# EAGLE design ArduinoLab (EAGLE 5.11)
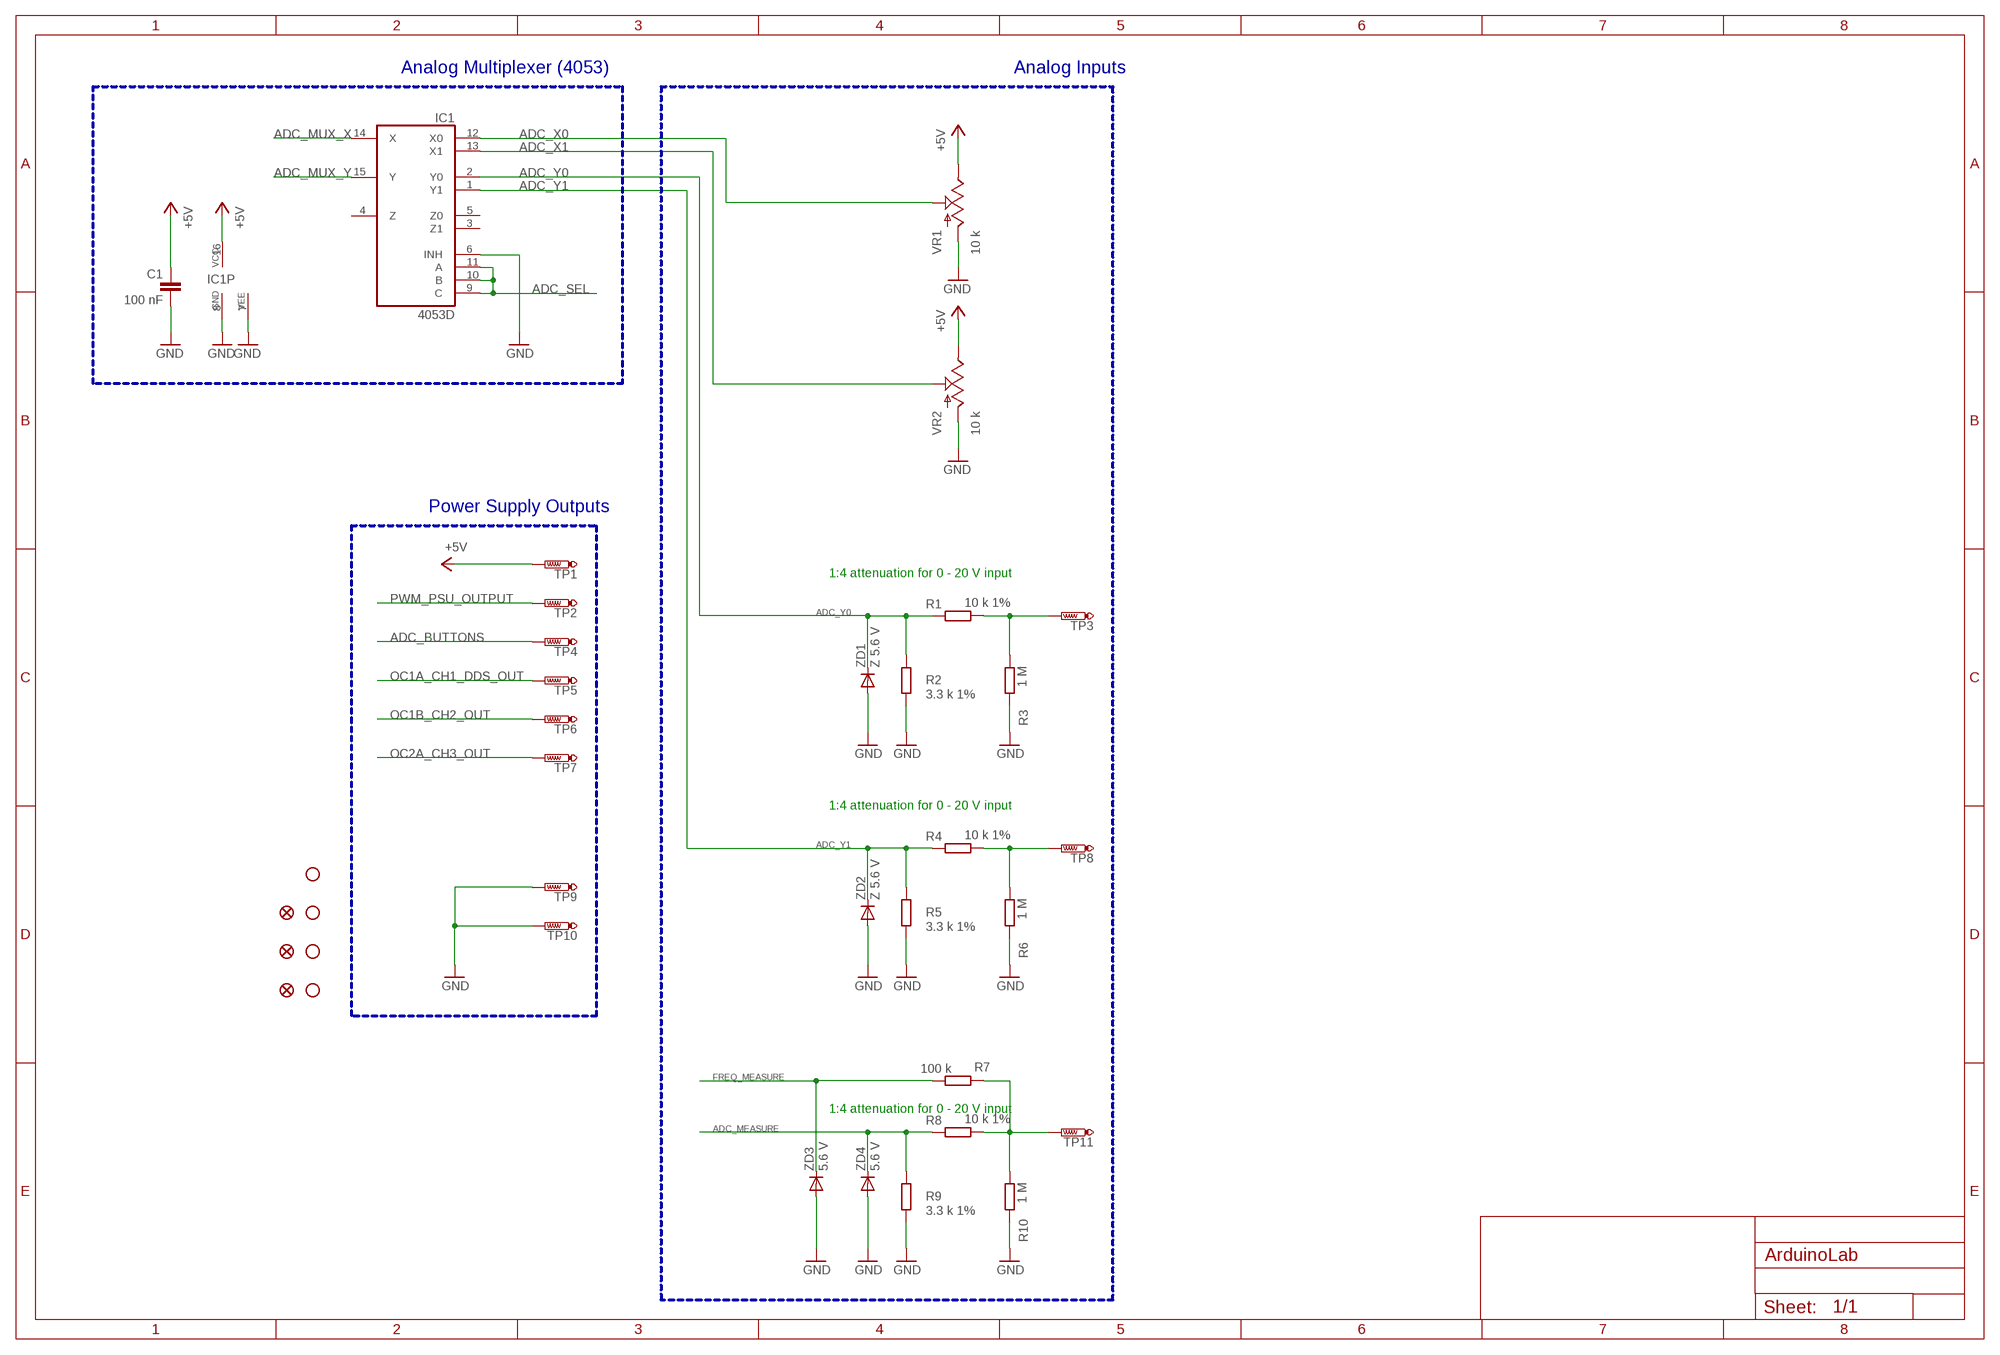
[diagram p0: schematic, sheet 1, part 1 of 3]
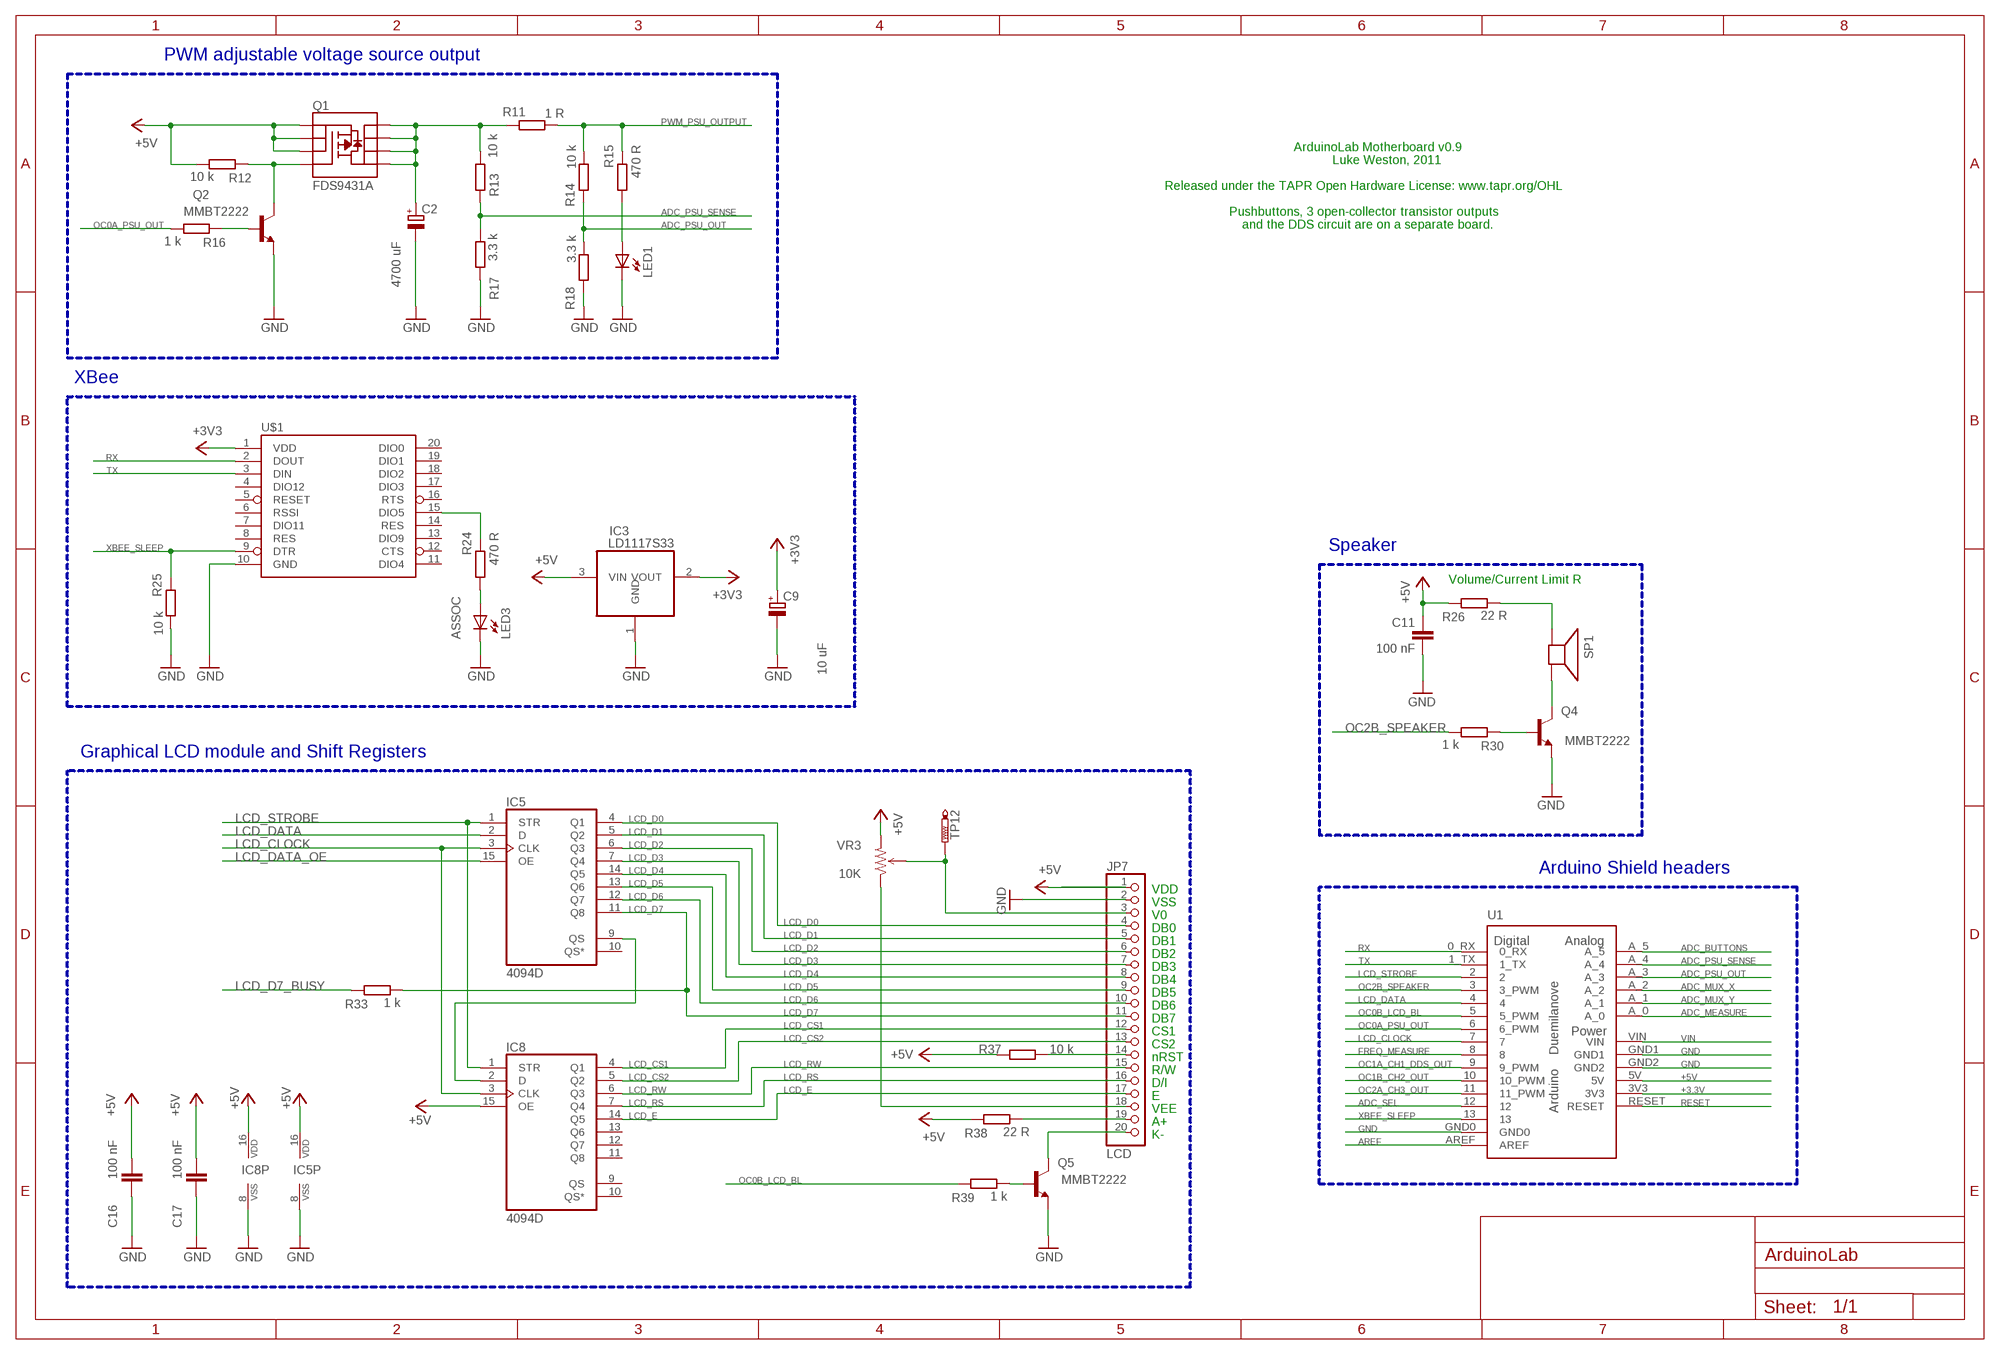
[diagram p1: schematic, sheet 1, part 2 of 3]
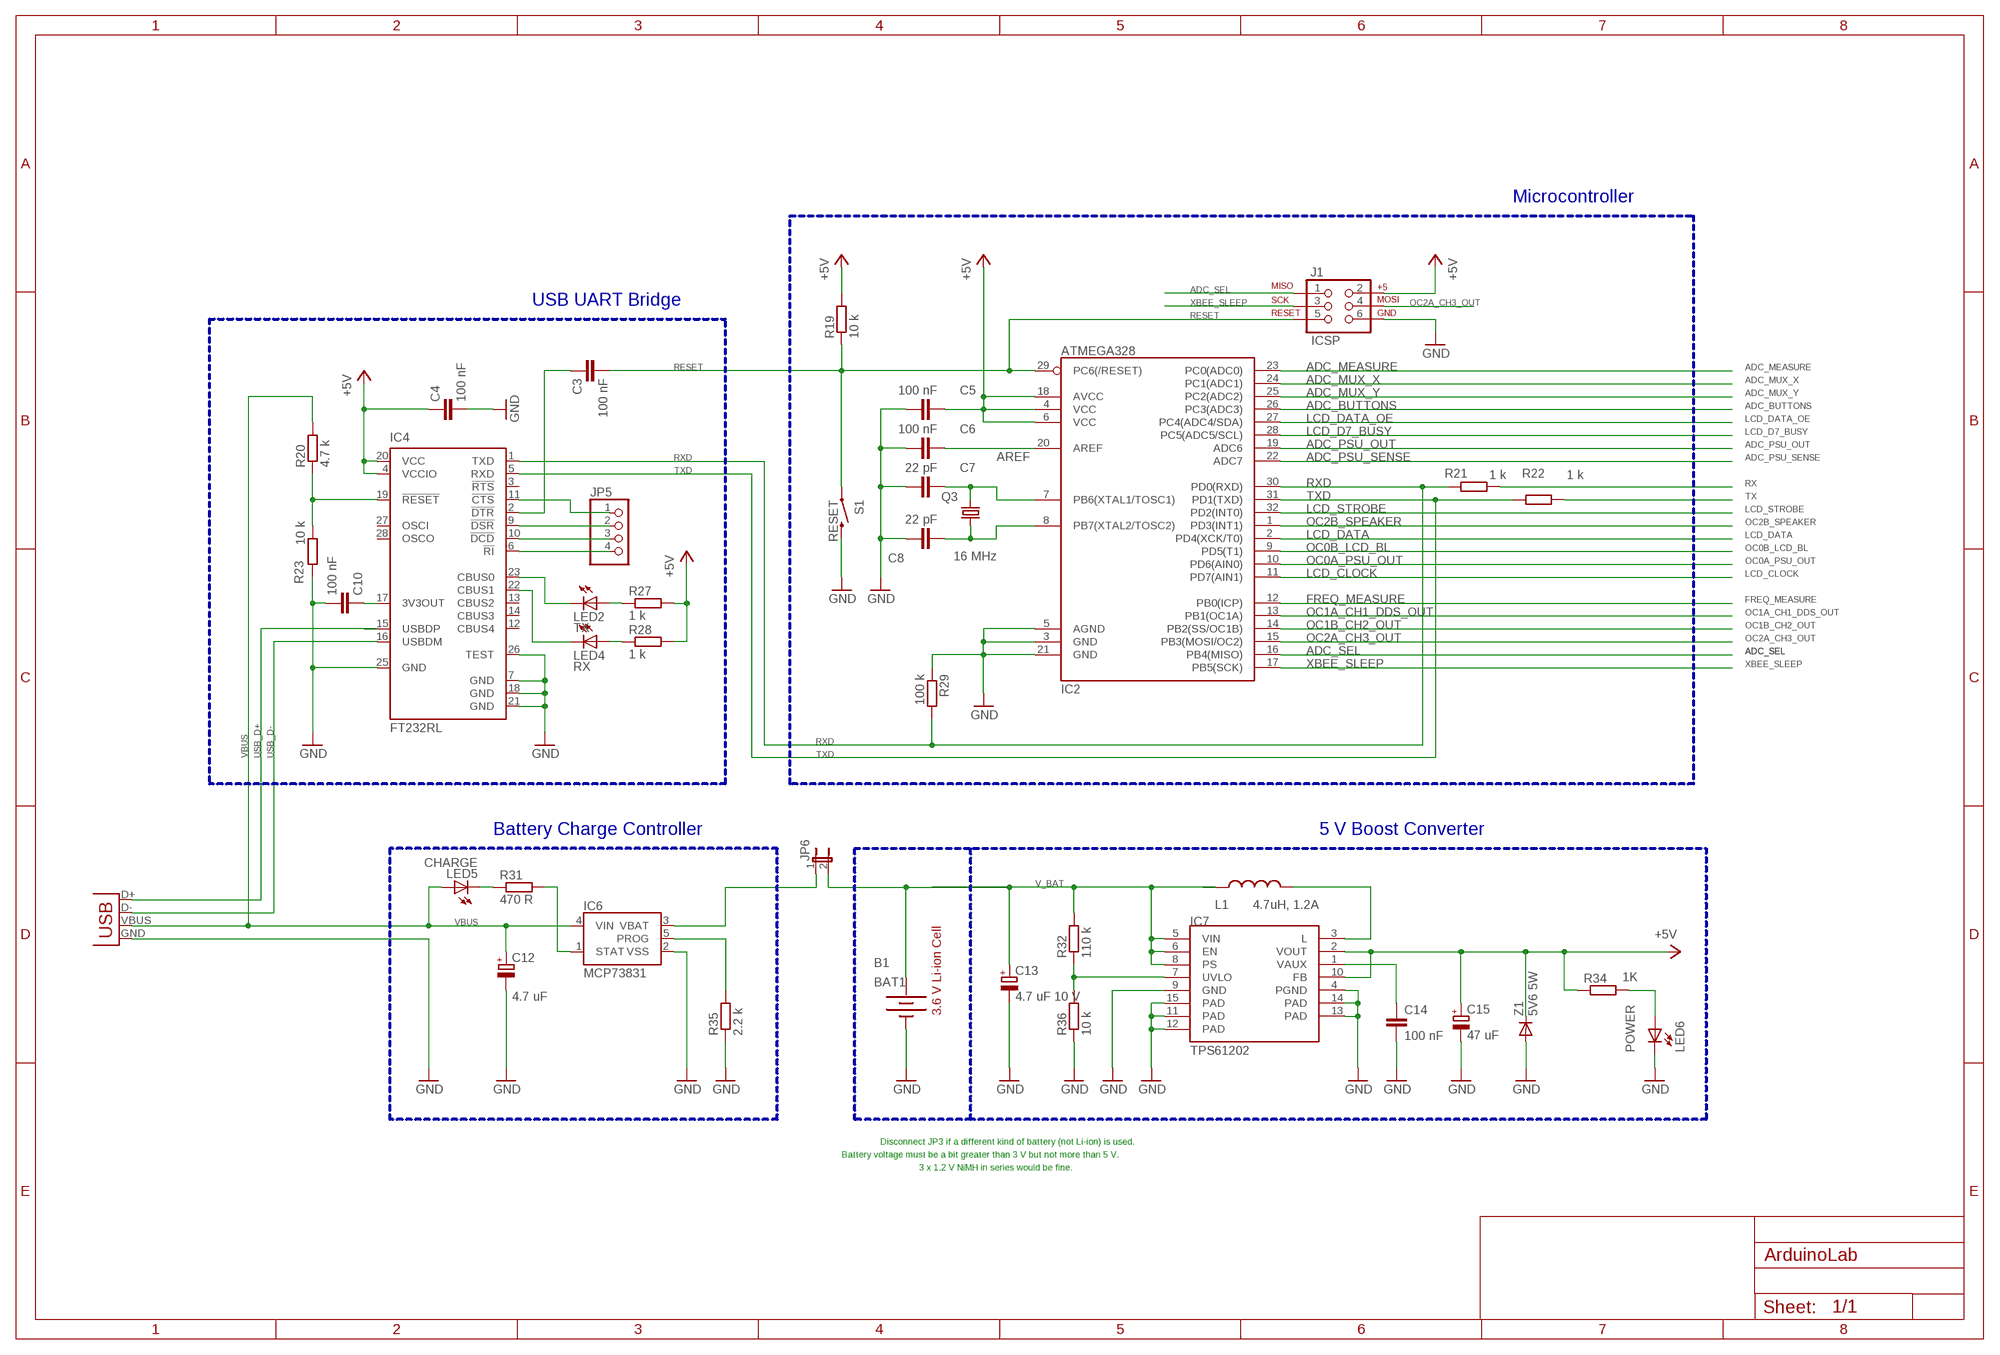
[diagram p2: schematic, sheet 1, part 3 of 3]

## Parts
BAT1  B1  BATTERYAA  [BATTERY-AA]
C1  100 nF  C-EUC0805K  [C0805K]
C2  4700 uF  CPOL-EUE5-13  [E5-13]
C3  100 nF  C-EUC0805K  [C0805K]
C4  100 nF  C-EUC0805K  [C0805K]
C5  100 nF  C-EUC0805K  [C0805K]
C6  100 nF  C-EUC0805K  [C0805K]
C7  22 pF  C-EUC0805K  [C0805K]
C8  22 pF  C-EUC0805K  [C0805K]
C9  10 uF  CPOL-EUSMCC  [SMC_C]
C10  100 nF  C-EUC0805K  [C0805K]
C11  100 nF  C-EUC0805K  [C0805K]
C12  4.7 uF  CPOL-EUSMCA  [SMC_A]
C13  4.7 uF 10 V  CPOL-EUSMCA  [SMC_A]
C14  100 nF  C-EUC0805K  [C0805K]
C15  47 uF  CPOL-EUSMCC  [SMC_C]
C16  100 nF  C-EUC0805K  [C0805K]
C17  100 nF  C-EUC0805K  [C0805K]
IC1  4053D  [SO16]
IC2  ATMEGA328  ATMEGA168  [TQFP32-08]
IC3  LD1117S33  REG1117  [SOT223]
IC4  FT232RL  [SSOP28]
IC5  4094D  [SO16]
IC6  MCP73831  [SOT23-5]
IC7  TPS61202  TPS61200  [QFN-10_PAD]
IC8  4094D  [SO16]
J1  ICSP  AVR_SPI_PRG_6NS  [2X3-NS]
JP1  STAND-OFF  [STAND-OFF]
JP2  STAND-OFF  [STAND-OFF]
JP3  STAND-OFF  [STAND-OFF]
JP4  STAND-OFF  [STAND-OFF]
JP5  PINHD-1X4  [1X04]
JP6  JP1E  [JP1]
JP7  LCD  PINHD-1X20  [1X20]
JP8  FIDUCIAL1.5X3  [FIDUCIAL-1.5X3]
JP9  FIDUCIAL1.5X3  [FIDUCIAL-1.5X3]
JP10  FIDUCIAL1.5X3  [FIDUCIAL-1.5X3]
L1  4.7uH, 1.2A  INDUCTOR-B82462G  [B82462G]
LED1  LEDCHIPLED_0805  [CHIPLED_0805]
LED2  TX  LEDCHIPLED_0805  [CHIPLED_0805]
LED3  ASSOC  LEDCHIPLED_0805  [CHIPLED_0805]
LED4  RX  LEDCHIPLED_0805  [CHIPLED_0805]
LED5  CHARGE  LEDCHIPLED_0805  [CHIPLED_0805]
LED6  POWER  LEDCHIPLED_0805  [CHIPLED_0805]
Q1  FDS9431A  MOSFET-PCHANNEL-SOIC8SOIC8  [SO08]
Q2  MMBT2222  MMBT2222ALT1-NPN-SOT23-BEC  [SOT23-BEC]
Q3  16 MHz  CRYSTALSM49  [SM49]
Q4  MMBT2222  MMBT2222ALT1-NPN-SOT23-BEC  [SOT23-BEC]
Q5  MMBT2222  MMBT2222ALT1-NPN-SOT23-BEC  [SOT23-BEC]
R1  10 k 1%  R-EU_R0805  [R0805]
R2  3.3 k 1%  R-EU_R0805  [R0805]
R3  1 M  R-EU_R0805  [R0805]
R4  10 k 1%  R-EU_R0805  [R0805]
R5  3.3 k 1%  R-EU_R0805  [R0805]
R6  1 M  R-EU_R0805  [R0805]
R7  100 k  R-EU_R0805  [R0805]
R8  10 k 1%  R-EU_R0805  [R0805]
R9  3.3 k 1%  R-EU_R0805  [R0805]
R10  1 M  R-EU_R0805  [R0805]
R11  1 R  R-EU_R2512  [R2512]
R12  10 k  R-EU_R0805  [R0805]
R13  10 k  R-EU_R0805  [R0805]
R14  10 k  R-EU_R0805  [R0805]
R15  470 R  R-EU_R0805  [R0805]
R16  1 k  R-EU_R0805  [R0805]
R17  3.3 k  R-EU_R0805  [R0805]
R18  3.3 k  R-EU_R0805  [R0805]
R19  10 k  R-EU_R0805  [R0805]
R20  4.7 k  R-EU_R0805  [R0805]
R21  1 k  R-EU_R0805  [R0805]
R22  1 k  R-EU_R0805  [R0805]
R23  10 k  R-EU_R0805  [R0805]
R24  470 R  R-EU_R0805  [R0805]
R25  10 k  R-EU_R0805  [R0805]
R26  22 R  R-EU_R0805  [R0805]
R27  1 k  R-EU_R0805  [R0805]
R28  1 k  R-EU_R0805  [R0805]
R29  100 k  R-EU_R0805  [R0805]
R30  1 k  R-EU_R0805  [R0805]
R31  470 R  R-EU_R0805  [R0805]
R32  110 k  R-EU_R0805  [R0805]
R33  1 k  R-EU_R0805  [R0805]
R34  1K  R-EU_R0805  [R0805]
R35  2.2 k  R-EU_R0805  [R0805]
R36  10 k  R-EU_R0805  [R0805]
R37  10 k  R-EU_R0805  [R0805]
R38  22 R  R-EU_R0805  [R0805]
R39  1 k  R-EU_R0805  [R0805]
S1  RESET  SWITCH-MOMENTARY-2SMD  [TACTILE_SWITCH_SMD]
SP1  SPEAKER/AL60P  [AL60P]
TP1  PTR1PAD1-13Y  [P1-13Y]
TP2  PTR1PAD1-13Y  [P1-13Y]
TP3  PTR1PAD1-13Y  [P1-13Y]
TP4  PTR1PAD1-13Y  [P1-13Y]
TP5  PTR1PAD1-13Y  [P1-13Y]
TP6  PTR1PAD1-13Y  [P1-13Y]
TP7  PTR1PAD1-13Y  [P1-13Y]
TP8  PTR1PAD1-13Y  [P1-13Y]
TP9  PTR1PAD1-13Y  [P1-13Y]
TP10  PTR1PAD1-13Y  [P1-13Y]
TP11  PTR1PAD1-13Y  [P1-13Y]
TP12  PTR1PAD1-13Y  [P1-13Y]
U1  ARDUINO-USBNO-OUTLINE-NO-TEXT-OCTAGONAL  [NO-OUTLINE-OCTAGONAL-NOTEXT]
U$1  XBEE-1B3  [XBEE-SMD]
VR1  10 k  POT100K_3362U  [3362U]
VR2  10 k  POT100K_3362U  [3362U]
VR3  10K  TRIMPOTSMD  [TRIMPOT-3MM]
X1  USB  USBOLD  [USB-MINIB-OLD]
Z1  5V6 5W  DIODE-D-10  [D-10]
ZD1  Z 5.6 V  DIODE-SOD323-W  [SOD323-W]
ZD2  Z 5.6 V  DIODE-SOD323-W  [SOD323-W]
ZD3  5.6 V  DIODE-SOD323-W  [SOD323-W]
ZD4  5.6 V  DIODE-SOD323-W  [SOD323-W]

## Nets
+3.3V: C9.+ IC3.2(VOUT) U1.3V3 U$1.1(VDD) ; supply symbol labelled +3V3
+5V: C1.1 C4.1 C5.1 C11.1 C15.+ C16.1 C17.1 IC1.16(VCC) IC2.4(VCC) IC2.6(VCC) IC2.18(AVCC) IC3.3(VIN) IC4.4(VCCIO) IC4.20(VCC) IC5.16(VDD) IC7.2(VOUT) IC7.10(FB) IC8.15(OE) IC8.16(VDD) J1.2 JP7.1 Q1.1(S) Q1.2(S) Q1.3(S) R12.1 R19.2 R26.1 R27.2 R28.2 R34.2 R37.2 R38.1 TP1.TP U1.5V VR1.P$1(E) VR2.P$1(E) VR3.3(CW) Z1.C
ADC_BUTTONS: IC2.26(PC3(ADC3)) TP4.TP U1.A_5
ADC_MEASURE: IC2.23(PC0(ADC0)) R8.2 R9.1 U1.A_0 ZD4.C
ADC_MUX_X: IC1.14(X) IC2.24(PC1(ADC1)) U1.A_2
ADC_MUX_Y: IC1.15(Y) IC2.25(PC2(ADC2)) U1.A_1
ADC_PSU_OUT: IC2.19(ADC6) R14.2 R18.1 U1.A_3
ADC_PSU_SENSE: IC2.22(ADC7) R13.1 R17.2 U1.A_4
ADC_SEL: IC1.9(C) IC1.10(B) IC1.11(A) IC2.16(PB4(MISO)) J1.1 U1.12
ADC_X0: IC1.12(X0) VR1.P$2(S)
ADC_X1: IC1.13(X1) VR2.P$2(S)
ADC_Y0: IC1.2(Y0) R1.2 R2.1 ZD1.C
ADC_Y1: IC1.1(Y1) R4.2 R5.1 ZD2.C
AREF: C6.2 IC2.20(AREF) U1.AREF
FREQ_MEASURE: IC2.12(PB0(ICP)) R7.2 U1.8 ZD3.C
GND: BAT1.GND@1(-) C1.2 C2.- C4.2 C5.2 C6.1 C7.1 C8.1 C9.- C10.2 C11.2 C12.- C13.- C14.2 C15.- C16.2 C17.2 IC1.6(INH) IC1.7(VEE) IC1.8(GND) IC2.3(GND) IC2.5(AGND) IC2.21(GND) IC3.1(GND) IC4.7(GND) IC4.18(GND) IC4.21(GND) IC4.25(GND) IC4.26(TEST) IC5.8(VSS) IC6.2(VSS) IC7.4(PGND) IC7.9(GND) IC7.11(PAD) IC7.12(PAD) IC7.13(PAD) IC7.14(PAD) IC7.15(PAD) IC8.8(VSS) J1.6 JP7.2 LED1.C LED3.C LED6.C Q2.E Q4.E Q5.E R2.2 R3.1 R5.2 R6.1 R9.2 R10.1 R17.1 R18.2 R23.1 R25.1 R29.1 R35.1 R36.1 S1.3 TP9.TP TP10.TP U1.GND0 U1.GND1 U1.GND2 U$1.10(GND) VR1.P$3(A) VR2.P$3(A) X1.GND Z1.A ZD1.A ZD2.A ZD3.A ZD4.A
LCD_CLOCK: IC2.11(PD7(AIN1)) IC5.3(CLK) IC8.3(CLK) U1.7
LCD_CS1: IC8.4(Q1) JP7.12
LCD_CS2: IC8.5(Q2) JP7.13
LCD_D0: IC5.4(Q1) JP7.4
LCD_D1: IC5.5(Q2) JP7.5
LCD_D2: IC5.6(Q3) JP7.6
LCD_D3: IC5.7(Q4) JP7.7
LCD_D4: IC5.14(Q5) JP7.8
LCD_D5: IC5.13(Q6) JP7.9
LCD_D6: IC5.12(Q7) JP7.10
LCD_D7: IC5.11(Q8) JP7.11 R33.2
LCD_D7_BUSY: IC2.28(PC5(ADC5/SCL)) R33.1
LCD_DATA: IC2.2(PD4(XCK/T0)) IC5.2(D) U1.4
LCD_DATA_OE: IC2.27(PC4(ADC4/SDA)) IC5.15(OE)
LCD_E: IC8.14(Q5) JP7.17
LCD_RESET: JP7.14 R37.1
LCD_RS: IC8.7(Q4) JP7.16
LCD_RW: IC8.6(Q3) JP7.15
LCD_STROBE: IC2.32(PD2(INT0)) IC5.1(STR) IC8.1(STR) U1.2
MEASURE_INPUT: R7.1 R8.1 R10.2 TP11.TP
N$1: LED3.A R24.2
N$2: R1.1 R3.2 TP3.TP
N$4: R26.2 SP1.1(+)
N$5: IC4.19(!RESET) R20.1 R23.2
N$6: IC7.3(L) L1.P$2
N$7: C7.2 IC2.7(PB6(XTAL1/TOSC1)) Q3.2
N$8: LED5.C R31.1
N$9: IC7.7(UVLO) R32.1 R36.2
N$10: C14.1 IC7.1(VAUX)
N$11: IC6.5(PROG) R35.2
N$12: C10.1 IC4.17(3V3OUT)
N$13: IC4.23(CBUS0) LED2.C
N$14: IC6.1(STAT) R31.2
N$15: IC4.22(CBUS1) LED4.C
N$16: C8.2 IC2.8(PB7(XTAL2/TOSC2)) Q3.1
N$17: C3.1 IC4.2(!DTR)
N$18: IC4.6(!RI) JP5.4
N$19: IC4.11(!CTS) JP5.1
N$20: IC4.9(!DSR) JP5.2
N$21: IC4.10(!DCD) JP5.3
N$22: LED2.A R27.1
N$23: LED4.A R28.1
N$30: IC6.3(VBAT) JP6.1
N$32: Q1.4(G) Q2.C R12.2
N$33: C2.+ Q1.5(D) Q1.6(D) Q1.7(D) Q1.8(D) R11.2 R13.2
N$38: LED6.A R34.1
N$42: JP7.3 TP12.TP VR3.2(WIPER)
N$44: JP7.18 VR3.1(CCW)
N$45: Q5.B R39.2
N$46: JP7.19 R38.2
N$47: JP7.20 Q5.C
N$48: IC5.9(QS) IC8.2(D)
N$52: Q2.B R16.2
N$53: R24.1 U$1.15(DIO5)
N$54: LED1.A R15.2
N$59: Q4.C SP1.2(-)
N$60: Q4.B R30.2
N$556: R4.1 R6.2 TP8.TP
OC0A_PSU_OUT: IC2.10(PD6(AIN0)) R16.1 U1.6(6_PWM)
OC0B_LCD_BL: IC2.9(PD5(T1)) R39.1 U1.5(5_PWM)
OC1A_CH1_DDS_OUT: IC2.13(PB1(OC1A)) TP5.TP U1.9(9_PWM)
OC1B_CH2_OUT: IC2.14(PB2(SS/OC1B)) TP6.TP U1.10(10_PWM)
OC2A_CH3_OUT: IC2.15(PB3(MOSI/OC2)) J1.4 TP7.TP U1.11(11_PWM)
OC2B_SPEAKER: IC2.1(PD3(INT1)) R30.1 U1.3(3_PWM)
PWM_PSU_OUTPUT: R11.1 R14.1 R15.1 TP2.TP
RESET: C3.2 IC2.29(PC6(/RESET)) J1.5 R19.1 S1.1 U1.RESET
RX: R21.1 U1.0_RX U$1.2(DOUT)
RXD: IC2.30(PD0(RXD)) IC4.1(TXD) R21.2 R29.2
TX: R22.1 U1.1_TX U$1.3(DIN)
TXD: IC2.31(PD1(TXD)) IC4.5(RXD) R22.2
USB_D+: IC4.15(USBDP) X1.D+
USB_D-: IC4.16(USBDM) X1.D-
V_BAT: BAT1.PWR@1(+) C13.+ IC7.5(VIN) IC7.6(EN) IC7.8(PS) JP6.2 L1.P$1 R32.2
VBUS: C12.+ IC6.4(VIN) LED5.A R20.2 X1.VBUS
VIN: U1.VIN
XBEE_SLEEP: IC2.17(PB5(SCK)) J1.3 R25.2 U1.13 U$1.9(DTR)
Unconnected: IC1.3(Z1) IC1.4(Z) IC1.5(Z0) IC4.3(!RTS) IC4.12(CBUS4) IC4.13(CBUS2) IC4.14(CBUS3) IC4.27(OSCI) IC4.28(OSCO) IC5.10(QS*) IC8.9(QS) IC8.10(QS*) IC8.11(Q8) IC8.12(Q7) IC8.13(Q6) U$1.4(DIO12) U$1.5(RESET) U$1.6(RSSI) U$1.7(DIO11) U$1.8(RES) U$1.11(DIO4) U$1.12(CTS) U$1.13(DIO9) U$1.14(RES) U$1.16(RTS) U$1.17(DIO3) U$1.18(DIO2) U$1.19(DIO1) U$1.20(DIO0)

## Buses
B$4
B$1
B$2
B$3

## Notes on the sheet
- Analog Multiplexer (4053) | Analog Inputs
- Power Supply Outputs
- 1:4 attenuation for 0 - 20 V input
- 1:4 attenuation for 0 - 20 V input
- 1:4 attenuation for 0 - 20 V input
- PWM adjustable voltage source output
- ArduinoLab Motherboard v0.9
- Luke Weston, 2011
- Released under the TAPR Open Hardware License: www.tapr.org/OHL
- Microcontroller
- Pushbuttons, 3 open-collector transistor outputs
- and the DDS circuit are on a separate board.
- USB UART Bridge
- XBee
- Speaker
- Volume/Current Limit R
- Graphical LCD module and Shift Registers
- Battery Charge Controller | 5 V Boost Converter
- Arduino Shield headers
- VDD
- VSS
- V0
- 3.6 V Li-ion Cell
- DB0
- DB1
- DB2
- DB3
- DB4
- DB5
- DB6
- DB7
- CS1
- CS2
- nRST
- R/W
- D/I
- E
- VEE
- A+
- K-
- Disconnect JP3 if a different kind of battery (not Li-ion) is used.
- Battery voltage must be a bit greater than 3 V but not more than 5 V.
- 3 x 1.2 V NiMH in series would be fine.

## Library data of the parts
BAT1 = SparkFun:BATTERY: Battery Holders Various common sizes : AA, AAA, 20mm coin cell and 12mm coin cell.
C1 C3-C8 C10 C11 C14 C16 C17 = rcl:C-EU: CAPACITOR, European symbol
C2 C9 C12 C13 C15 = rcl:CPOL-EU: POLARIZED CAPACITOR, European symbol
IC1 = 40xx:4053: Triple 2-channel ANALOG MULTIPLEXER
IC2 = SparkFun:ATMEGA168
IC3 = burr-brown:REG1117: 800mA and 1A Low Dropout (LDO) Positive Regulator 1.8V, 2.5V, 2.85V, 3.3V, 5V, and Adj; MPN: REG1117; OC_FARNELL: 1097566; OC_NEWARK: 14P6981
IC4 = ftdichip:FT232R: Source: http://www.ftdichip.com/Documents/DataSheets/DS_FT232R_v104.pdf; MPN: FT232RL; OC_FARNELL: 1146032; OC_NEWARK: 91K9918
IC5 IC8 = 40xx:4094: 8-stage SHIFT/STORE REGISTER, tri-state
IC6 = SparkFun:MCP73831: Microchip's MCP73831 Miniature single cell, fully integrated Li-Ion, Li-polymer charge management controller http://ww1.microchip.com/downloads/en/DeviceDoc/21984a.pdf
IC7 = SparkFun:TPS61200: DC to DC Booster
J1 = SparkFun:AVR_SPI_PRG_6: AVR ISP 6 Pin This is the reduced ISP connector for AVR programming. Common on Arduino. This footprint will take up less PCB space and can be used with a 10-pin to 6-pin adapter such as SKU: BOB-08508
JP1-JP4 = SparkFun:STAND-OFF: Stand Off This is the mechanical footprint for a #4 phillips button head screw. Use the keepout ring to avoid running the screw head into surrounding components. SKU : PRT-00447
JP5 = pinhead:PINHD-1X4: PIN HEADER
JP6 = jumper:JP1E: JUMPER
JP7 = pinhead:PINHD-1X20: PIN HEADER
JP8-JP10 = SparkFun:FIDUCIAL: Fiducial Alignment Points Various fiducial points for machine vision alignment.
L1 = SparkFun:INDUCTOR: Inductors Basic Inductor/Choke - 0603 and 1206. Footprints are not proven and vary greatly between part numbers.
LED1-LED6 = led:LED: LED OSRAM: - CHIPLED LG R971, LG N971, LY N971, LG Q971, LY Q971, LO R971, LY R971 LH N974, LH R974 LS Q976, LO Q976, LY Q976 LO Q996 - Hyper CHIPLED LW Q18S LB Q993, LB Q99A, LB R99A - SideLED LS A670, LO A670, LY A670, LG A670, LP A670 LB A673, LV A673, LT A673, LW A673 LH A674 LY A675 LS A676, LA A676, LO A676, LY A676, LW A676 LS A679, LY A679, LG A679 - Hyper Micro SIDELED® LS Y876, LA Y876, LO Y876, LY Y876 LT Y87S - SmartLED LW L88C, LW L88S LB L89C, LB L89S, LG L890 LS L89K, LO L89K, LY L89K LS L896, LA L896, LO L896, LY L896 - TOPLED LS T670, LO T670, LY T670, LG T670, LP T670 LSG T670, LSP T670, LSY T670, LOP T670, LYG T670 LG T671, LOG T671, LSG T671 LB T673, LV T673, LT T673, LW T673 LH T674 LS T676, LA T676, LO T676, LY T676, LB T676, LH T676, LSB T676, LW T676 LB T67C, LV T67C, LT T67C, LS T67K, LO T67K, LY T67K, LW E67C LS E67B, LA E67B, LO E67B, LY E67B, LB E67C, LV E67C, LT E67C LW T67C LS T679, LY T679, LG T679 LS T770, LO T770, LY T770, LG T770, LP T770 LB T773, LV T773, LT T773, LW T773 LH T774 LS E675, LA E675, LY E675, LS T675 LS T776, LA T776, LO T776, LY T776, LB T776 LHGB T686 LT T68C, LB T68C - Hyper Mini TOPLED® LB M676 - Mini TOPLED Santana® LG M470 LS M47K, LO M47K, LY M47K Source: http://www.osram.convergy.de LUXEON: - LUMILED® LXK2-PW12-R00, LXK2-PW12-S00, LXK2-PW14-U00, LXK2-PW14-V00 LXK2-PM12-R00, LXK2-PM12-S00, LXK2-PM14-U00 LXK2-PE12-Q00, LXK2-PE12-R00, LXK2-PE12-S00, LXK2-PE14-T00, LXK2-PE14-U00 LXK2-PB12-K00, LXK2-PB12-L00, LXK2-PB12-M00, LXK2-PB14-N00, LXK2-PB14-P00, LXK2-PB14-Q00 LXK2-PR12-L00, LXK2-PR12-M00, LXK2-PR14-Q00, LXK2-PR14-R00 LXK2-PD12-Q00, LXK2-PD12-R00, LXK2-PD12-S00 LXK2-PH12-R00, LXK2-PH12-S00 LXK2-PL12-P00, LXK2-PL12-Q00, LXK2-PL12-R00 Source: www.luxeon.com KINGBRIGHT: KA-3528ASYC Source: www.kingbright.com
Q1 = SparkFun:MOSFET-PCHANNEL-SOIC8
Q2 Q4 Q5 = transistor:*-NPN-: NPN Transistror BF959 corrected 2008.03.06
Q3 = crystal:CRYSTAL: CRYSTAL; OC_FARNELL: unknown; OC_NEWARK: unknown
R1-R39 = rcl:R-EU_: RESISTOR, European symbol
S1 = SparkFun:SWITCH-MOMENTARY-2
SP1 = adafruit:SPEAKER: SPEAKER Source: Buerklin Added PS12 (for part # PS1240 piezo) http://www.ladyada.net/library/pcb/eaglelibrary.html
TP1-TP12 = testpad:PTR1: TEST PIN
U1 = Arduino-Various:ARDUINO-USB: The Ardiuno Duemilanove Pinouts layoutet as a Bare Shield. v0.5 Also for Arduino Diecimila. This is designed as a Part and has no Outline in the Dimension Layer. The Outline, when present, is drawed at the tPlace / bPlace Layer. Library by Stephanie Lange, http://www.k-ita.de/~sl/
U$1 = SparkFun:XBEE-1
VR1 VR2 = SparkFun:POT
VR3 = SparkFun:TRIMPOT
X1 = SparkFun:USB: USB Connectors USB-B-PTH is fully proven SKU : PRT-00139 USB-miniB is fully proven SKU : PRT-00587 USB-A-PCB is untested. USB-A-H is throughly reviewed, but untested. Spark Fun Electronics SKU : PRT-00437 USB-B-SMT is throughly reviewed, but untested. Needs silkscreen touching up. USB-A-S has not been used/tested USB-MB-H has not been used/tested
Z1 ZD1-ZD4 = diode:DIODE-: DIODE

## Board
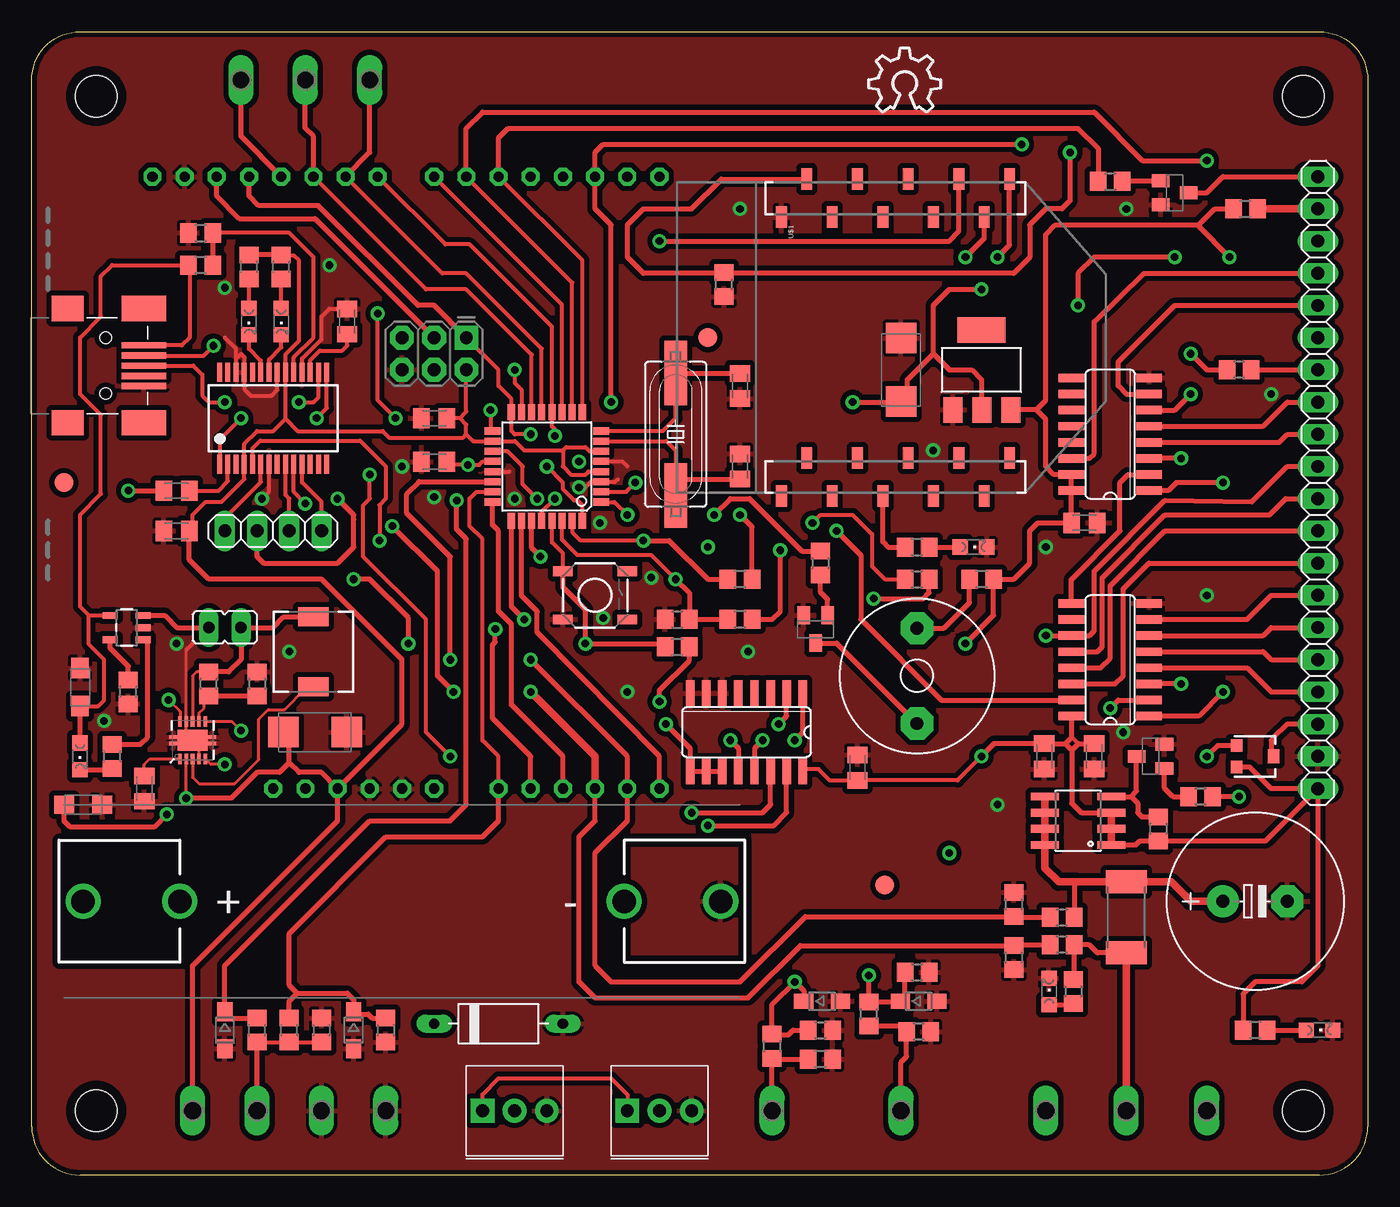
[diagram p3: board, top side]
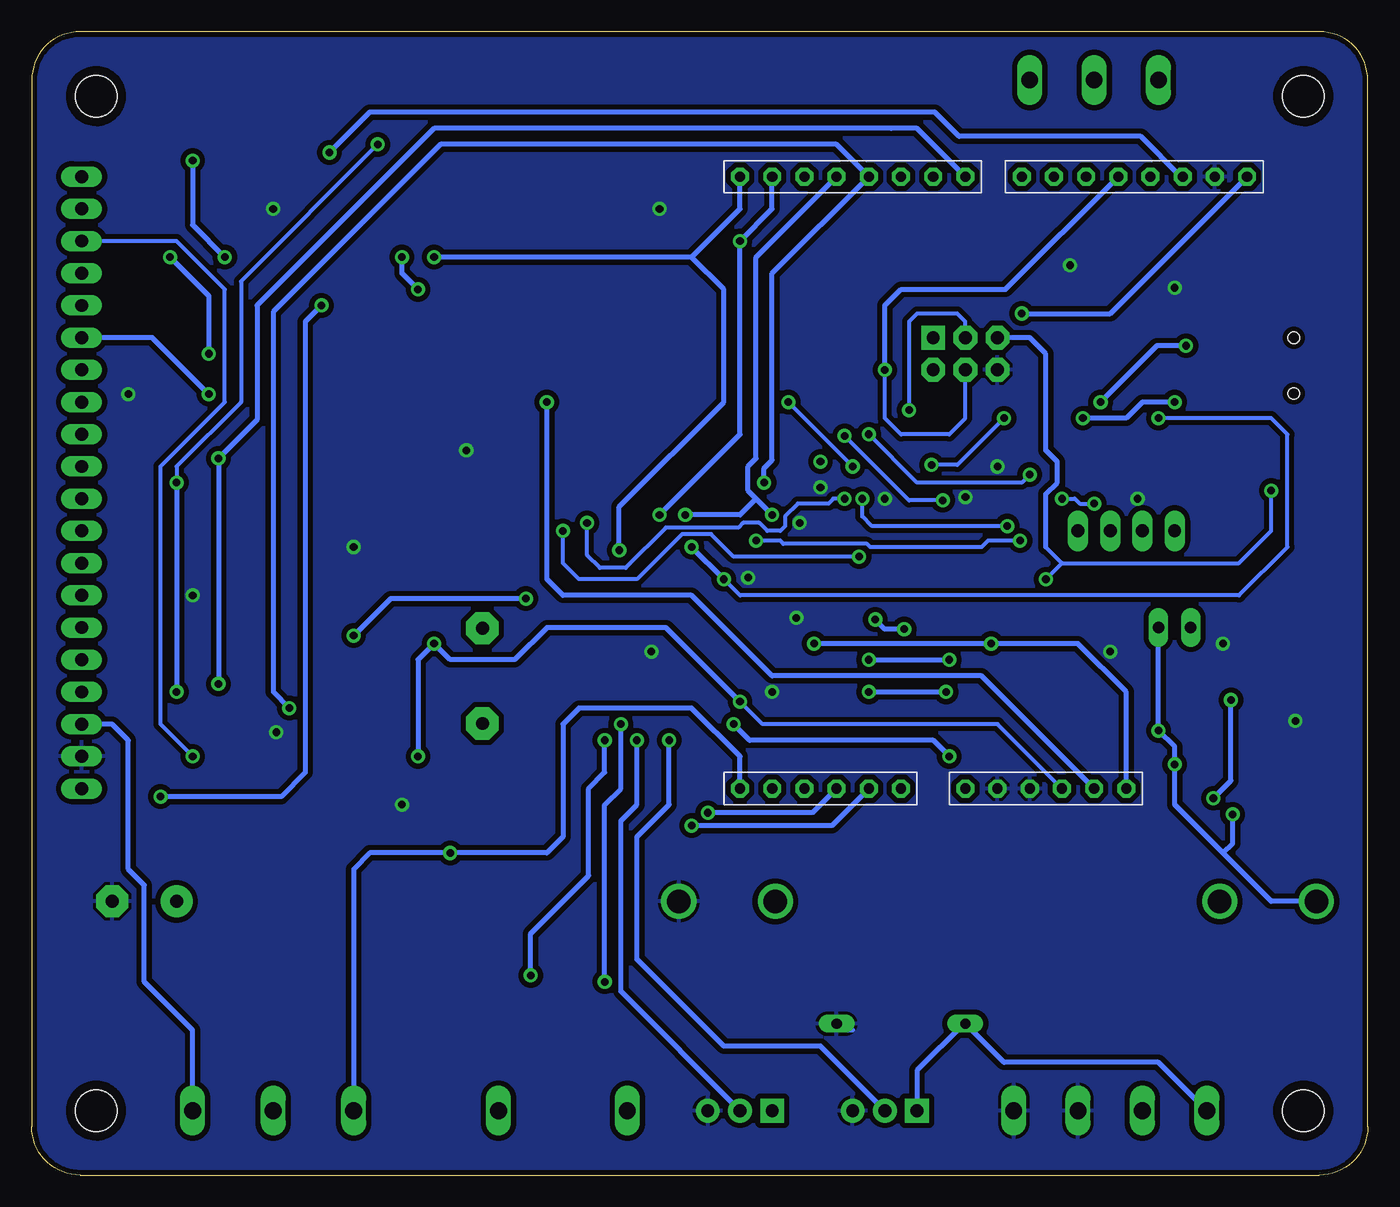
[diagram p4: board, bottom side, seen from below]

Size 105.41 x 90.17 mm. Coordinates in mm from the lower left corner, seen from the top.
Outline: 3.81,90.17 101.6,90.17 arc-90 105.41,86.36 105.41,3.81 arc-90 101.6,0 3.81,0 arc-90 0,3.81 0,86.36 arc-90 3.81,90.17
Copper layers (1*16): Top 0.035mm / dielectric 1.5mm / Bottom 0.035mm
Design rules "SparkFun.drc": minimum track width 8mil, minimum drill 20mil, track to track 8mil, track to pad 8mil, pad to pad 8mil, via to via 8mil, smd to smd 8mil, copper to edge 10mil, drill to drill 8mil, minimum pad ring 12mil, minimum via ring 10mil, stop-mask expansion 4mil, vias tented up to drill 25mil, thermal gap 10mil

### Footprints (pad centres in the part's own frame; a part is rotated, then mirrored left to right if it is on the bottom)
BATTERY-AA = drill 1.854 round: GND@1 25.146,0; GND@2 17.526,0; PWR@1 -25.146,0; PWR@2 -17.526,0
C0805K = smd 1.3 x 1.6: 1 -1,0; 2 1,0
E5-13 = drill 1.016 pad 2.54 round: + -2.54,0 | drill 1.016 pad 2.54 octagon: - 2.54,0
SMC_C = smd 2.4 x 2.4: + -2.5,0; - 2.5,0
SMC_A = smd 1.6 x 1.4: + -1.5,0; - 1.5,0
SO16 = smd 0.66 x 2.032: 1 -4.445,-3.073; 2 -3.175,-3.073; 3 -1.905,-3.073; 4 -0.635,-3.073; 5 0.635,-3.073; 6 1.905,-3.073; 7 3.175,-3.073; 8 4.445,-3.073; 9 4.445,3.073; 10 3.175,3.073; 11 1.905,3.073; 12 0.635,3.073; 13 -0.635,3.073; 14 -1.905,3.073; 15 -3.175,3.073; 16 -4.445,3.073
TQFP32-08 = smd 1.27 x 0.559: 1 -4.293,2.8; 2 -4.293,2; 3 -4.293,1.2; 4 -4.293,0.4; 5 -4.293,-0.4; 6 -4.293,-1.2; 7 -4.293,-2; 8 -4.293,-2.8; 17 4.293,-2.8; 18 4.293,-2; 19 4.293,-1.2; 20 4.293,-0.4; 21 4.293,0.4; 22 4.293,1.2; 23 4.293,2; 24 4.293,2.8 | smd 0.559 x 1.27: 9 -2.8,-4.293; 10 -2,-4.293; 11 -1.2,-4.293; 12 -0.4,-4.293; 13 0.4,-4.293; 14 1.2,-4.293; 15 2,-4.293; 16 2.8,-4.293; 25 2.8,4.293; 26 2,4.293; 27 1.2,4.293; 28 0.4,4.293; 29 -0.4,4.293; 30 -1.2,4.293; 31 -2,4.293; 32 -2.8,4.293
SOT223 = smd 1.499 x 2.007: 1 -2.261,-3.15; 2 0.025,-3.15; 3 2.311,-3.15 | smd 3.81 x 2.007: 4 0,3.15
SSOP28 = smd 0.4 x 1.5: 1 -4.225,-3.625; 2 -3.575,-3.625; 3 -2.925,-3.625; 4 -2.275,-3.625; 5 -1.625,-3.625; 6 -0.975,-3.625; 7 -0.325,-3.625; 8 0.325,-3.625; 9 0.975,-3.625; 10 1.625,-3.625; 11 2.275,-3.625; 12 2.925,-3.625; 13 3.575,-3.625; 14 4.225,-3.625; 15 4.225,3.625; 16 3.575,3.625; 17 2.925,3.625; 18 2.275,3.625; 19 1.625,3.625; 20 0.975,3.625; 21 0.325,3.625; 22 -0.325,3.625; 23 -0.975,3.625; 24 -1.625,3.625; 25 -2.275,3.625; 26 -2.925,3.625; 27 -3.575,3.625; 28 -4.225,3.625
SOT23-5 = smd 0.55 x 1.2: 1 -0.95,-1.3; 2 0,-1.3; 3 0.95,-1.3; 4 0.95,1.3; 5 -0.95,1.3
QFN-10_PAD = smd 0.297 x 0.85: 1 -1,-1.475; 2 -0.5,-1.475; 3 0,-1.475; 4 0.5,-1.475; 5 1,-1.475; 6 1,1.475; 7 0.5,1.475; 8 0,1.475; 9 -0.5,1.475; 10 -1,1.475 | smd 0.7 x 0.28: 11 -1.5,0.25; 12 -1.5,-0.25; 13 1.5,0.25; 14 1.5,-0.25 | smd 2.4 x 1.65: 15 0,0
2X3-NS = drill 1.016 pad 1.88 square: 1 -2.54,-1.27 | drill 1.016 pad 1.88 octagon: 2 -2.54,1.27; 3 0,-1.27; 4 0,1.27; 5 2.54,-1.27; 6 2.54,1.27
STAND-OFF = hole 3.302: 0,0
1X04 = drill 1.016 long: 1 -3.81,0; 2 -1.27,0; 3 1.27,0; 4 3.81,0
JP1 = drill 0.914 long: 1 0,-1.27; 2 0,1.27
1X20 = drill 1.016 long: 1 -24.13,0; 2 -21.59,0; 3 -19.05,0; 4 -16.51,0; 5 -13.97,0; 6 -11.43,0; 7 -8.89,0; 8 -6.35,0; 9 -3.81,0; 10 -1.27,0; 11 1.27,0; 12 3.81,0; 13 6.35,0; 14 8.89,0; 15 11.43,0; 16 13.97,0; 17 16.51,0; 18 19.05,0; 19 21.59,0; 20 24.13,0
FIDUCIAL-1.5X3 = smd 1.5 x 1.5: 1 0,0
B82462G = smd 2.4 x 1.5: P$1 0,2.75; P$2 0,-2.75
CHIPLED_0805 = smd 1.2 x 1.2: A 0,-1.05; C 0,1.05
SO08 = smd 0.61 x 2.21: 1 -1.905,-2.616; 2 -0.635,-2.616; 3 0.635,-2.616; 4 1.905,-2.616; 5 1.905,2.616; 6 0.635,2.616; 7 -0.635,2.616; 8 -1.905,2.616
SOT23-BEC = smd 1 x 1.4: B -0.95,-1.1; C 0,1.1; E 0.95,-1.1
SM49 = smd 5.08 x 1.778: 1 -4.826,0; 2 4.826,0
R0805 = smd 1.3 x 1.5: 1 -0.95,0; 2 0.95,0
R2512 = smd 1.8 x 3.2: 1 -2.8,0; 2 2.8,0
TACTILE_SWITCH_SMD = smd 1.524 x 0.762: 1 -2.54,1.905; 2 2.54,1.905; 3 -2.54,-1.905; 4 2.54,-1.905
AL60P = drill 1.016 pad 2.54 octagon: 1 -3.759,0; 2 3.759,0
P1-13Y = drill 1.321 pad 1.905 long: TP 0,0
NO-OUTLINE-OCTAGONAL-NOTEXT = drill 0.8 pad 1.27 octagon: 0_RX -25.4,27.94; 1_TX -25.4,25.4; 2 -25.4,22.86; 3 -25.4,20.32; 3V3 22.86,0; 4 -25.4,17.78; 5 -25.4,15.24; 5V 22.86,2.54; 6 -25.4,12.7; 7 -25.4,10.16; 8 -25.4,5.715; 9 -25.4,3.175; 10 -25.4,0.635; 11 -25.4,-1.905; 12 -25.4,-4.445; 13 -25.4,-6.985; A_0 22.86,15.24; A_1 22.86,17.78; A_2 22.86,20.32; A_3 22.86,22.86; A_4 22.86,25.4; A_5 22.86,27.94; AREF -25.4,-12.065; GND0 -25.4,-9.525; GND1 22.86,7.62; GND2 22.86,5.08; RESET 22.86,-2.54; VIN 22.86,10.16
XBEE-SMD = smd 1.7 x 0.85: 1 -12.5,20; 2 -9.5,18; 3 -12.5,16; 4 -9.5,14; 5 -12.5,12; 6 -9.5,10; 7 -12.5,8; 8 -9.5,6; 9 -12.5,4; 10 -9.5,2; 11 12.5,2; 12 9.5,4; 13 12.5,6; 14 9.5,8; 15 12.5,10; 16 9.5,12; 17 12.5,14; 18 9.5,16; 19 12.5,18; 20 9.5,20
3362U = drill 1.016 pad 1.88 square: P$1 0,2.54 | drill 1.016 pad 1.88 round: P$2 2.54,2.54; P$3 5.08,2.54
TRIMPOT-3MM = smd 1 x 0.9: 1 -0.85,-1.45; 3 0.85,-1.45 | smd 1.1 x 0.9: 2 0,1.45
USB-MINIB-OLD = smd 2.5 x 2: 1 -3,-4.5; 2 -3,4.5 | smd 3.5 x 2: 3 3,-4.5; 4 3,4.5 | smd 3.5 x 0.5: D+ 3,0; D- 3,0.8; GND 3,-1.6; ID 3,-0.8; VBUS 3.01,1.61 | hole 0.9: 0,2.2; 0,-2.2
D-10 = drill 0.813 long: A 5.08,0; C -5.08,0
SOD323-W = smd 1.5 x 1.2: A 1.45,0; C -1.45,0

### Placement (x,y rotation side)
BAT1  29.21,21.59 0 top
C1  79.88,33.02 270 top
C2  96.52,21.59 0 top
C3  11.43,53.98 180 top
C4  11.43,50.8 180 top
C5  31.75,59.69 180 top
C6  31.75,56.26 0 top
C7  55.88,55.88 270 top
C8  55.88,62.23 90 top
C9  68.58,63.5 90 top
C10  24.89,67.31 90 top
C11  65.15,32.13 90 top
C12  3.81,38.48 90 top
C13  4.06,29.21 0 top
C14  8.89,30.48 270 top
C15  22.35,34.92 0 top
C16  83.82,33.02 270 top
C17  83.06,51.43 0 top
IC1  56.39,34.92 180 top
IC2  40.64,55.88 180 top
IC3  74.93,63.5 0 top
IC4  19.05,59.69 0 top
IC5  85.09,40.64 90 top
IC6  7.49,43.18 90 top
IC7  12.7,34.29 0 top
IC8  85.09,58.42 90 top
J1  31.75,64.77 180 top
JP1  5.08,85.09 0 top
JP2  5.08,5.08 0 top
JP3  100.33,5.08 0 top
JP4  100.33,85.09 0 top
JP5  19.05,50.8 180 top
JP6  15.24,43.18 270 top
JP7  101.47,54.61 90 top
JP8  2.54,54.61 0 top
JP9  53.34,66.04 0 top
JP10  67.31,22.86 0 top
L1  22.22,41.27 0 top
LED1  80.26,14.48 0 top
LED2  17.14,67.31 180 top
LED3  74.3,49.53 270 top
LED4  19.68,67.31 180 top
LED5  3.81,33.02 180 top
LED6  101.6,11.43 270 top
Q1  82.55,27.94 90 top
Q2  88.27,33.02 90 top
Q3  50.8,58.42 270 top
Q4  61.85,43.05 180 top
Q5  90.17,77.47 270 top
R1  58.42,10.16 90 top
R2  62.23,11.43 0 top
R3  62.23,9.14 180 top
R4  66.04,12.7 90 top
R5  69.85,16 0 top
R6  69.98,11.3 180 top
R7  17.78,11.43 90 top
R8  20.32,11.43 90 top
R9  27.94,11.43 270 top
R10  22.86,11.43 270 top
R11  86.36,20.32 90 top
R12  88.9,27.3 90 top
R13  81.28,20.32 0 top
R14  81.28,18.16 180 top
R15  82.17,14.48 270 top
R16  92.2,29.84 180 top
R17  77.47,21.34 270 top
R18  77.47,17.14 270 top
R19  50.93,41.66 0 top
R20  13.33,71.75 180 top
R21  55.88,43.81 180 top
R22  55.88,46.99 180 top
R23  13.33,74.3 0 top
R24  69.85,49.53 0 top
R25  54.61,70.23 90 top
R26  74.93,46.99 180 top
R27  17.14,71.63 90 top
R28  19.68,71.63 90 top
R29  50.93,43.81 0 top
R30  62.23,48.26 270 top
R31  6.35,33.02 90 top
R32  13.97,38.73 90 top
R33  69.85,46.99 0 top
R34  96.52,11.43 180 top
R35  7.62,38.1 90 top
R36  17.78,38.73 270 top
R37  95.25,63.5 180 top
R38  95.76,76.2 0 top
R39  85.09,78.36 0 top
S1  44.45,45.72 0 top
SP1  69.85,39.37 270 top
TP1  12.7,5.08 0 top
TP2  86.36,5.08 0 top
TP3  58.42,5.08 0 top
TP4  80.01,5.08 0 top
TP5  26.67,86.36 0 top
TP6  21.59,86.36 0 top
TP7  16.51,86.36 0 top
TP8  68.58,5.08 0 top
TP9  27.94,5.08 0 top
TP10  22.86,5.08 0 top
TP11  17.78,5.08 0 top
TP12  92.71,5.08 0 top
U1  21.59,53.34 270 top
U$1  57.15,66.04 270 top
U$2  [OSHW_10X200_NOTEXT]  66.04,83.82 0 top
VR1  35.56,2.54 0 top
VR2  46.99,2.54 0 top
VR3  96.52,33.02 270 top
X1  5.84,63.83 0 top
Z1  36.83,11.94 0 top
ZD1  62.36,13.72 0 top
ZD2  69.98,13.72 0 top
ZD3  15.24,11.43 270 top
ZD4  25.4,11.43 270 top

### Tracks (layer width: path | path; a pad name or v marks a point on that pad's centre or on a via)
+3.3V  (via drill 0.6)
  Top 0.406: U$1.1 77.15,73.34 v76.2,72.39 | v74.93,69.85 72.39,69.85 71.12,68.58 71.12,64.77 | 71.12,64.77 72.39,63.5 74.17,63.5 74.93,62.74 74.93,60.38 IC3.2 | 71.12,64.77 69.09,62.74 69.09,61.51 C9.+ 68.54,60.96 v64.77,60.96
  Bottom 0.406: v74.93,69.85 76.2,71.12 v76.2,72.39 | U1.3V3 30.48,39.37 46.99,39.37 53.34,45.72 63.5,45.72 64.77,46.99 v64.77,60.96
+5V  (via drill 0.6)
  Top 0.254: IC7.10 11.7,36.56 v10.79,37.46 | v12.2,29.72 IC7.2
  Top 0.305: 34.29,58.42 34.83,57.88 IC2.18 38.13,57.88 38.86,57.15 41.91,57.15 | 34.29,58.42 34.29,59.18 33.78,59.69 | 33.78,59.69 C5.1 | J1.2 34.29,60.2 33.78,59.69 | R28.2 19.87,72.52 20.7,72.52 21.08,72.14 21.08,65.79 20.02,64.73 IC4.20 20.02,59.65 | C4.1 12.7,51.07 12.7,52.07 13.72,53.09 14.99,53.09 16.78,54.88 IC4.4 16.78,57.67 17.78,58.67 19.05,58.67 20.02,59.65 | 20.02,59.65 21,58.67 27.69,58.67 28.19,58.17 34.04,58.17 34.29,58.42 | C17.1 82.02,51.48 | 82.06,36.15 IC5.16 | 20.32,34.29 20.32,34.46 C15.+ | 82.06,34.54 82.58,34.02 | VR1.P$1 35.56,6.35 36.83,7.62 45.72,7.62 46.99,6.35 VR2.P$1 | IC1.16 61,32.02 62.09,32.02 62.99,31.12 65.14,31.12 C11.1 73.04,31.13 v74.93,33.02 | IC2.6 44.01,57.08 43.69,57.4 42.16,57.4 41.91,57.15 | 41.91,57.15 41.91,55.88 42.55,55.24 43.69,55.24 43.92,55.48 IC2.4
  Top 0.406: R28.2 R27.2 | C4.1 12.43,48.53 13.97,46.99 22.86,46.99 29.21,40.64 29.21,35.56 U1.5V | 82.02,51.48 IC8.16 IC8.15 80.64,55.24 80.01,55.88 80.01,59.61 79.27,60.35 | R38.1 93.34,76.2 92.08,74.93 91.95,74.93 | 91.95,74.93 80.77,74.93 80.01,74.17 80.01,61.09 79.27,60.35 | 82.06,36.15 82.06,34.54 81.53,34.02 | Q1.3 82.8,28.58 82.06,29.32 82.06,33.5 | 81.53,34.02 C1.1 79.87,34.04 75.95,34.04 v74.93,33.02 | 81.53,34.02 82.06,33.5 | C16.1 82.58,34.02 82.06,33.5 | 20.32,32.51 19.56,31.75 17.78,31.75 15.75,29.72 v12.2,29.72 v12.19,29.72 | 20.32,32.51 21.08,31.75 22.86,31.75 U1.5V | 20.32,32.51 20.32,34.29 | Q1.1 87.12,26.03 87.44,26.35 R12.1 97.35,26.35 JP7.1 | R19.2 51.88,40.57 49.53,38.23 v49.53,37.34 | C17.1 79.38,51.43 78.74,50.8 78.74,48.26 77.47,46.99 R26.1 75.88,44.13 v73.66,41.91 | 79.27,60.35 IC3.3 | U1.5V 24.13,27.94 12.7,16.51 TP1.TP | JP7.1 101.47,16.51 100.2,15.24 96.52,15.24 95.57,14.29 R34.2 | R37.2 92.71,63.5 v91.44,64.77 | 91.95,74.93 v94.49,72.39 | IC5.16 81.91,36.2 | VR3.3 96.1,32.17 97.79,30.48 JP7.1
  Top 0.61: Q1.3 Q1.2 Q1.1
  Bottom 0.305: U1.5V 29.21,35.56 47.75,35.56 v49.53,37.34
  Bottom 0.406: v10.79,37.46 10.79,31.12 v12.19,29.72 | v49.53,37.34 55.37,43.18 64.77,43.18 67.31,40.64 72.39,40.64 v73.66,41.91 74.93,40.64 v74.93,33.02 | TP1.TP 16.51,8.89 28.7,8.89 Z1.C 31.88,11.94 35.56,8.25 VR1.P$1 | v91.44,64.77 91.44,69.34 v94.49,72.39
ADC_BUTTONS  (via drill 0.6)
  Top 0.406: U1.A_5 49.53,33.02 39.94,42.74 39.88,42.8 39.88,44.45 38.64,45.69 IC2.26
  Bottom 0.406: TP4.TP 80.01,24.13 78.74,25.4 v72.39,25.4 64.77,25.4 63.5,26.67 63.5,35.56 62.23,36.83 53.34,36.83 49.53,33.02 U1.A_5
ADC_MEASURE
  Top 0.305: U1.A_0 36.83,33.02 35.56,34.29 35.56,50.16 34.54,51.18 34.54,53.34 35.08,53.88 IC2.23
  Top 0.406: U1.A_0 36.83,27.94 35.56,26.67 27.94,26.67 20.32,19.05 20.32,14.99 20.95,14.35 | R9.1 26.86,12.38 26.54,12.7 25.58,12.7 ZD4.C 25.4,13.84 24.89,14.35 20.95,14.35 | R8.2 20.32,13.72 20.95,14.35
ADC_MUX_X  (via drill 0.6)
  Top 0.406: IC1.14 58.29,29.21 57.66,28.58 v52.07,28.58 | U1.A_2 41.91,33.02 37.84,37.09 37.84,43.44 36.83,44.45 36.83,50.8 36.35,51.28 IC2.24
  Bottom 0.406: v52.07,28.58 43.82,28.58 U1.A_2
ADC_MUX_Y  (via drill 0.6)
  Top 0.305: U1.A_1 39.37,31.75
  Top 0.406: IC1.15 59.56,28.58 58.55,27.56 v53.34,27.56 | U1.A_1 39.37,33.02 36.35,36.04 36.35,41.81 36.58,42.04 v36.58,43.05 | IC2.25 37.84,44.84 v38.86,43.81
  Bottom 0.406: v53.34,27.56 42.29,27.56 U1.A_1 | v38.86,43.81 38.1,43.05 v36.58,43.05
ADC_PSU_OUT  (via drill 0.6)
  Top 0.305: IC2.19 37.54,57.08 38.74,55.88 38.74,54.48 v39.88,53.34
  Top 0.406: U1.A_3 44.45,27.94 43.18,26.67 43.18,15.24 44.45,13.97 56.52,13.97 60.64,18.09 R18.1 77.54,18.16 R14.2 | v28.45,51.18 32,47.62 32,39.37 v33.27,38.1
  Top 0.61: U1.A_3 44.45,33.02 v39.37,38.1
  Bottom 0.305: v39.88,53.34 39.88,51.94 39.12,51.18 v28.45,51.18
  Bottom 0.406: v39.37,38.1 v33.27,38.1
ADC_PSU_SENSE  (via drill 0.6)
  Top 0.406: R13.1 77.54,20.32 R17.2 61.03,20.39 55.88,15.24 45.72,15.24 44.45,16.51 44.45,25.4 46.99,27.94 U1.A_4 46.99,33.02 v39.37,40.64 | IC2.22 30.55,54.68 29.59,53.72 29.59,52.2 33.02,48.77 v33.02,40.64
  Bottom 0.406: v39.37,40.64 v33.02,40.64
ADC_SEL  (via drill 0.6)
  Top 0.305: J1.1 36.83,63.5 36.83,62.23 37.84,61.22 IC2.16 37.84,58.68 38.1,58.42 v39.37,58.42 | v26.67,55.24 26.67,53.34 26.16,52.83 26.16,48.77 31.11,43.81 31.11,34.92 v33.02,33.02
  Top 0.406: U1.12 17.14,77.22 17.91,76.45 22.61,76.45 30.48,68.58 31.75,68.58 J1.1 | IC1.11 IC1.10 IC1.9 51.94,33.66 v50.04,35.56
  Bottom 0.305: v26.67,55.24 27.3,54.61 35.56,54.61 v39.37,58.42
  Bottom 0.406: v50.04,35.56 48.77,34.29 34.29,34.29 v33.02,33.02
ADC_X0  (via drill 0.6)
  Top 0.406: IC1.12 55.75,33.66 v55.12,34.29
  Bottom 0.406: v55.12,34.29 55.12,29.21 57.66,26.67 57.66,17.02 50.8,10.16 43.18,10.16 VR1.P$2
ADC_X1  (via drill 0.6)
  Top 0.406: IC1.13 57.02,33.66 v57.66,34.29
  Bottom 0.406: v57.66,34.29 57.66,29.21 58.93,27.94 58.93,14.48 VR2.P$2
ADC_Y0  (via drill 0.6)
  Top 0.406: IC1.2 59.56,36.2 v58.93,35.56 | R2.1 60.07,11.43 59.69,11.05 58.48,11.05 R1.2 58.42,13.46 v60.2,15.24 60.91,14.53 ZD1.C
  Bottom 0.406: v58.93,35.56 58.93,30.48 60.2,29.21 v60.2,15.24
ADC_Y1  (via drill 0.6)
  Top 0.406: IC1.1 60.83,34.92 v60.2,34.29 | v66.04,15.75 R4.2 68.46,13.65 ZD2.C 68.9,14.09 R5.1
  Bottom 0.406: v60.2,34.29 60.2,31.75 61.47,30.48 61.47,23.62 66.04,19.05 v66.04,15.75
AREF  (via drill 0.6)
  Top 0.305: C6.2 32.77,56.28 | v27.3,67.95 27.3,61.09 v28.7,59.69 | IC2.20 35.58,56.28 35.31,56.01 v34.42,56.01 33,56.01 C6.2 | C6.2 32.75,56.02 32.77,56.01
  Bottom 0.305: v28.7,59.69 32.38,56.01 v34.42,56.01
  Bottom 0.406: U1.AREF 20.32,67.95 v27.3,67.95
FREQ_MEASURE  (via drill 0.6)
  Top 0.305: U1.8 32.64,73.41 34.54,73.41 41.04,66.91 IC2.12 41.04,59.04 41.28,58.8 v41.28,58.29
  Top 0.406: v33.53,53.21 33.53,50.93 34.29,50.16 34.29,29.21 33.02,27.94 26.67,27.94 15.24,16.51 ZD3.C 15.74,12.38 R7.2
  Bottom 0.305: v41.28,58.29 36.2,53.21 v33.53,53.21
GND  (via drill 0.6)
  Top 0.254: 12.2,41.41 IC7.9 12.2,34.79 | IC7.4 13.2,33.79 | IC7.14 12.95,34.04 IC7.15 | 12.45,34.54 IC7.11
  Top 0.305: 15.24,66.04 16.12,65.16 IC4.26 16.12,64.39 16.51,64.77 16.78,64.5 IC4.25 16.76,63.3 16.76,61.98 17.27,61.47 18.92,61.47 19.38,61.92 IC4.21 | IC2.21 37.7,55.48 | IC4.18 21.32,64.38 22.86,65.91 22.86,67.69 23.5,68.33 24.88,68.33 C10.2 | IC4.7 18.72,53.9 v18.16,53.34 | IC2.5 46.59,56.28 46.99,55.88 | 12.2,41.41 12.7,41.91 | v43.18,54.23 43.69,54.23 44.14,54.68 IC2.3 46.04,54.68 46.23,54.86 | 12.2,34.79 12.45,34.54 IC7.15 13.2,33.79
  Bottom 0.406: Z1.A 41.15,11.94 40.64,11.43 41.91,11.43
  other vias: 44.83,51.43 15.24,69.98 92.71,45.72 97.79,61.59 48.9,47.12 5.71,35.81 11.43,41.91 20.32,41.27 46.99,38.1 38.1,53.34 55.88,76.2 86.36,76.2 80.01,49.53 71.12,57.15 76.2,29.21 31.75,53.47 23.5,71.75 29.21,55.88 45.09,43.94 56.52,41.27 86.11,34.92
  pour Top (isolate 0.406): 106.68,-1.27 -3.81,-1.27 -3.81,92.71 106.68,92.71
  pour Bottom (isolate 0.406): -3.81,92.71 106.68,92.71 106.68,-1.27 -3.81,-1.27
LCD_CLOCK  (via drill 0.6)
  Top 0.305: IC2.11 41.84,68.65 U1.7
  Top 0.406: v90.68,38.73 IC5.3 | v90.68,56.52 IC8.3
  Bottom 0.406: v90.68,38.73 v90.68,56.52 87.63,59.56 87.63,68.58 73.66,82.55 37.59,82.55 35.56,82.55 U1.7
LCD_CS1
  Top 0.406: IC8.4 98.42,57.78 99.06,58.42 JP7.12
LCD_CS2
  Top 0.406: JP7.13 99.06,60.96 97.16,59.05 IC8.5
LCD_D0
  Top 0.406: IC5.4 95.88,40 97.79,38.1 JP7.4
LCD_D1
  Top 0.406: IC5.5 97.16,41.27 97.79,40.64 JP7.5
LCD_D2
  Top 0.406: IC5.6 97.16,42.55 97.79,43.18 JP7.6
LCD_D3
  Top 0.406: IC5.7 95.88,43.81 97.79,45.72 JP7.7
LCD_D4
  Top 0.406: IC5.14 85.47,38.73 86.11,39.37 86.11,46.23 88.14,48.26 JP7.8
LCD_D5
  Top 0.406: IC5.13 84.33,40 85.09,40.77 85.09,46.48 89.41,50.8 JP7.9
LCD_D6
  Top 0.406: JP7.10 98.93,53.34 97.66,52.07 89.41,52.07 84.45,47.12 84.45,41.66 84.07,41.27 IC5.12
LCD_D7  (via drill 0.6)
  Top 0.406: JP7.11 99.06,55.88 96.27,53.09 89.41,53.21 83.82,47.62 83.82,42.93 83.44,42.55 IC5.11 v80.01,42.55 | R33.2 70.8,45.91 70.36,45.47 v66.42,45.47
  Bottom 0.406: v66.42,45.47 77.09,45.47 v80.01,42.55
LCD_D7_BUSY  (via drill 0.6)
  Top 0.305: IC2.28 40.24,52.3 v41.28,53.34 | v61.6,51.43 62.23,52.07 64.77,52.07 66.29,50.55 66.29,48.01 67.31,46.99 R33.1
  Bottom 0.305: v61.6,51.43 61.6,48.89 60.58,47.88 58.55,47.88 55.37,51.05 49.66,51.05 49.28,51.43 48.01,51.43 47.37,50.8 46.36,50.8 45.97,51.18 45.97,51.94 44.96,52.96 42.55,52.96 42.16,53.34 v41.28,53.34
LCD_DATA  (via drill 0.6)
  Top 0.305: IC2.2 46.9,53.88 v47.62,54.61
  Top 0.406: IC5.2 85.72,37.46 v85.09,36.83
  Bottom 0.406: v47.62,54.61 47.62,55.75 46.99,56.39 46.99,71.12 U1.4 41.91,81.28 73.15,81.28 86.36,68.07 86.36,38.1 v85.09,36.83
LCD_DATA_OE  (via drill 0.6)
  Top 0.406: IC2.27 39.44,49.46 v40.13,48.77 | v63.5,50.8 65.41,48.89 65.41,43.81 71.75,37.46 IC5.15
  Bottom 0.305: v40.13,48.77 50.04,48.77 51.82,50.55 54.1,50.55 57.66,46.99 62.23,46.99 63.5,48.26 v63.5,50.8
LCD_E
  Top 0.406: JP7.17 87.76,71.12 83.82,67.31 83.82,56.9 83.44,56.52 IC8.14
LCD_RESET
  Top 0.406: R37.1 JP7.14
LCD_RS
  Top 0.406: JP7.16 90.17,68.58 88.33,66.74 88.16,66.57 85.72,64.14 85.72,62.23 86.36,61.59 IC8.7
LCD_RW  (via drill 0.6)
  Top 0.406: IC8.6 90.17,60.32 v91.44,61.59
  Bottom 0.406: JP7.15 95.88,66.04 v91.44,61.59
LCD_STROBE  (via drill 0.6)
  Top 0.305: IC2.32 43.44,52.83 43.05,53.21 42.8,53.21 41.91,54.1 41.91,54.61 v40.64,55.88
  Top 0.406: IC5.1 92.08,36.2 v93.98,38.1 | v45.72,60.96 45.72,74.93 44.45,76.2 U1.2 44.45,80.64 45.09,81.28 v78.1,81.28 | v93.98,54.61 90.3,54.61 89.66,53.98 IC8.1
  Bottom 0.305: v93.98,54.61 93.98,55.88 88.9,60.96 88.9,70.48 v78.1,81.28 | v40.64,55.88 v45.72,60.96
  Bottom 0.406: v93.98,54.61 v93.98,38.1
MEASURE_INPUT
  Top 0.305: R7.1 R8.1 R10.2
  Top 0.406: TP11.TP R7.1
N$1
  Top 0.406: R24.2 LED3.A
N$2
  Top 0.406: R3.2 58.49,9.14 R1.1 TP3.TP
N$4
  Top 0.406: SP1.1 71.96,43.13 73.98,45.15 R26.2
N$5
  Top 0.305: R20.1 R23.2 | 14.29,74.23 14.35,74.3 20.32,74.3 22.22,72.39 22.22,66.04 20.68,64.49 IC4.19
  Top 0.406: 14.29,74.23 R20.1
N$6
  Top 0.254: IC7.3 12.7,31.37 13.21,30.86 16,30.86 17.91,32.77 17.91,35.94 18.67,36.7 19.94,36.7 21.59,38.35
  Top 0.305: 21.59,38.35 22.05,38.35 L1.P$2
N$7
  Top 0.305: IC2.7 50.07,57.88 50.8,57.15 50.8,54.61 | 50.8,54.61 Q3.2 | 50.8,54.61 51.07,54.88
  Top 0.406: 51.07,54.88 C7.2
N$8
  Top 0.305: 6.25,31.97 R31.1
  Top 0.406: LED5.C 6.25,31.97
N$9
  Top 0.254: IC7.7 13.2,36.44 13.59,36.83 13.59,37.4
  Top 0.305: 13.59,37.4 R32.1
  Top 0.406: R32.1 R36.2
N$10
  Top 0.254: IC7.1 9.32,32.81 8.89,32.38 C14.1
N$11
  Top 0.406: IC6.5 6.19,41.56 7.62,40.13 R35.2
N$12
  Top 0.305: 24.88,66.29 C10.1 24.89,65.41 24.51,65.02 22.73,65.02 21.97,64.26 21.97,63.5 | 21.97,63.5 21.97,64.27 | IC4.17 21.97,63.5
N$13
  Top 0.305: IC4.23 18.07,64.22 17.14,65.15 LED2.C
N$14
  Top 0.406: IC6.1 9.14,42.13 9.14,34.54 8.57,33.97 R31.2
N$15
  Top 0.305: IC4.22 18.72,64.32 19.68,65.28 LED4.C
N$16
  Top 0.305: IC2.8 49.79,58.68 50.8,59.69 Q3.1 50.82,63.23
  Top 0.406: 50.82,63.23 C8.2
N$17
  Top 0.305: IC4.2 15.47,54.72 14.73,53.98 C3.1
N$18
  Top 0.305: JP5.4 15.24,51.82 18.07,54.65 IC4.6
N$19
  Top 0.305: IC4.11 21.32,54.62 22.86,53.09 JP5.1
N$20
  Top 0.305: IC4.9 20.02,53.63 20.32,53.34 JP5.2
N$21  (via drill 0.6)
  Top 0.305: IC4.10 20.68,53.87 v21.59,52.96
  Top 0.406: JP5.3 17.78,48.77 18.29,48.26 24.13,48.26 25.4,49.53 25.4,51.69 25.4,52.07 v24.13,53.34
  Bottom 0.305: v21.59,52.96 22.73,52.96 23.11,53.34 v24.13,53.34
N$22
  Top 0.305: LED2.A R27.1
N$23
  Top 0.305: LED4.A R28.1
N$26  (via drill 0.6)
  other vias: 43.18,56.26
N$30
  Top 0.406: IC6.3 10.48,44.13 11.43,43.18 JP6.1
N$32
  Top 0.406: Q2.C 87.16,30.27 86.74,29.84 | Q1.4 86.74,29.84 | 86.74,29.84 87.25,29.34 87.25,28.58 87.57,28.26 R12.2
N$33
  Top 0.406: R13.2 82.29,20.32 82.29,22.86 82.55,23.12
  Top 0.61: Q1.5 Q1.6 Q1.7 Q1.8 79.93,24.21 81.02,23.12 82.55,23.12 R11.2 89.91,23.12 91.44,21.59 C2.+
N$38
  Top 0.406: R34.1 LED6.A
N$42
  Top 0.305: 97.79,33.02 VR3.2
  Top 0.406: JP7.3 99.06,35.56 97.97,34.47 97.79,34.29 97.79,33.02
  Bottom 0.406: TP12.TP 92.71,11.43 96.52,15.24 96.52,22.86 97.79,24.13 97.79,34.29 99.06,35.56 JP7.3
N$44  (via drill 0.6)
  Top 0.406: VR3.1 93.56,33.87 v92.71,33.02
  Bottom 0.305: v92.71,33.02 95.25,35.56 95.25,55.88 90.17,60.96 90.17,69.85 93.98,73.66 JP7.18
N$45
  Top 0.305: Q5.B 89.01,78.36 | R39.2 86.1,78.42
  Top 0.406: 86.1,78.42 Q5.B
N$46
  Top 0.61: R38.2 JP7.19
N$47
  Top 0.406: JP7.20 93.98,78.74 92.71,77.47 Q5.C
N$48
  Top 0.406: IC8.2 86.49,55.24 85.85,54.61 85.85,50.8 82.02,46.96 IC5.9
N$52
  Top 0.406: R16.2 90.04,29.84 89.36,30.52 Q2.B
N$53
  Top 0.406: U$1.15 67.15,49.94 67.56,49.53 R24.1
N$54
  Top 0.406: LED1.A 82.07,13.43 R15.2
N$59
  Top 0.406: Q4.C 63.51,41.95 SP1.2
N$60
  Top 0.406: Q4.B 62.8,45.41 62.23,45.97 R30.2
N$556
  Top 0.406: R4.1 68.96,11.75 R6.2 69.03,9.34 68.58,8.89 TP8.TP
OC0A_PSU_OUT  (via drill 0.6)
  Top 0.305: IC2.10 42.64,70.39 U1.6
  Top 0.406: v95.25,29.84 R16.1 | U1.6 34.29,82.55 35.56,83.82 83.82,83.82 87.63,80.01 v92.71,80.01 | v90.17,72.39 83.82,72.39 82.55,71.12 v82.55,68.58
  Bottom 0.406: v95.25,29.84 85.72,29.84 83.82,31.75 83.82,67.31 v82.55,68.58 | v92.71,80.01 92.71,74.93 v90.17,72.39
OC0B_LCD_BL
  Top 0.305: IC2.9 43.44,72.13 U1.5
  Top 0.406: R39.1 84.14,80.96 82.55,82.55 37.59,82.55 36.83,81.79 U1.5
OC1A_CH1_DDS_OUT
  Top 0.305: IC2.13 40.24,65.17 34.29,71.12 32.38,71.12 U1.9
  Top 0.406: TP5.TP 26.67,80.64 U1.9
OC1B_CH2_OUT
  Top 0.305: IC2.14 39.44,64.7 34.29,69.85 31.11,69.85 U1.10
  Top 0.406: U1.10 22.22,81.91 21.59,82.55 TP6.TP
OC2A_CH3_OUT  (via drill 0.6)
  Top 0.305: IC2.15 38.64,61.94 38.1,62.48 v38.1,63.5
  Top 0.406: TP7.TP 16.51,81.91 U1.11
  Bottom 0.305: J1.4 31.75,59.69 33.02,58.42 36.83,58.42 38.1,59.69 v38.1,63.5
  Bottom 0.406: U1.11 28.57,69.85 36.83,69.85 38.1,68.58 v38.1,63.5
OC2B_SPEAKER  (via drill 0.6)
  Top 0.305: IC2.1 45.98,53.08 v46.99,52.07
  Top 0.406: R30.1 60.77,49.21 56.64,53.34 55.12,53.34 v53.85,52.07
  Bottom 0.406: U1.3 48.26,72.39 48.26,56.52 48.9,55.88 48.9,53.98 48.26,53.34 | 48.26,53.34 49.53,52.07 v53.85,52.07 | v46.99,52.07 48.26,53.34
PWM_PSU_OUTPUT
  Top 0.406: R11.1 84.07,17.53 83.44,18.16 R14.1 82.23,15.49 R15.1
  Top 0.61: TP2.TP R11.1
RESET  (via drill 0.6)
  Top 0.305: IC2.29 41.04,49.89 41.91,49.02 S1.1
  Top 0.406: S1.1 41.91,46.35 43.69,44.58 v43.69,41.91 49.72,41.91 R19.1 | v7.62,53.98 C3.2 | v25.4,46.99 26.67,46.99 29.72,43.94 v29.72,41.91
  Bottom 0.305: 24.13,48.26 10.16,48.26 7.62,50.8 v7.62,53.98 | 24.13,48.26 25.4,49.53 | v25.4,46.99 24.13,48.26
  Bottom 0.406: J1.5 26.67,66.04 25.4,64.77 25.4,57.15 24.51,56.26 24.51,54.61 25.4,53.72 25.4,49.53 | v43.69,41.91 v29.72,41.91 22.86,41.91 19.05,38.1 U1.RESET
RX  (via drill 0.6)
  Top 0.406: R21.1 58.42,43.81 59.05,44.45 v59.05,49.28 | U$1.2 75.15,73.88 v73.66,72.39
  Bottom 0.305: 49.53,76.2 50.8,74.93
  Bottom 0.406: v59.05,49.28 59.05,52.7 50.8,60.96 50.8,69.85 53.34,72.39 | 53.34,72.39 v73.66,72.39 | 53.34,72.39 49.53,76.2 U1.0_RX
RXD  (via drill 0.6)
  Top 0.305: IC2.30 41.84,50.11 43.05,48.89 48.9,48.89 v50.8,46.99 | IC4.1 14.82,58 v16.51,59.69
  Top 0.406: R21.2 R29.2 51.88,45.91 v50.8,46.99
  Bottom 0.305: v16.51,59.69 7.62,59.69 6.35,58.42 6.35,49.53 10.16,45.72 49.53,45.72 v50.8,46.99
  Bottom 0.406: v50.8,46.99 v53.34,49.53
TX  (via drill 0.6)
  Top 0.406: R22.1 56.83,51.12 v55.88,52.07 | U$1.3 73.15,74.42 72.39,73.66 v49.53,73.66
  Bottom 0.406: U1.1_TX 46.99,76.2 v49.53,73.66 49.53,58.42 v55.88,52.07
TXD  (via drill 0.6)
  Top 0.305: v48.26,50.04 43.31,50.04 42.67,50.67 42.67,51.55 IC2.31 | IC4.5 17.43,57.3 18.03,57.91 25.91,57.91 27.94,55.88 27.94,53.34 27.43,52.83 v27.43,50.04
  Top 0.406: v48.26,50.04 50.29,50.04 53.34,46.99 R22.2
  Bottom 0.305: v27.43,50.04 29.97,50.04 30.48,49.53 39.24,49.53 39.5,49.78 46.1,49.78 46.36,50.04 v48.26,50.04
USB_D+  (via drill 0.6)
  Top 0.305: X1.D+ 12.75,63.83 13.46,63.12 13.46,61.47 13.97,60.96 v15.24,60.96 | IC4.15 23.27,60.49 v22.48,59.69
  Bottom 0.406: v15.24,60.96 17.78,60.96 19.05,59.69 v22.48,59.69
USB_D-  (via drill 0.6)
  Top 0.305: X1.D- 13.58,64.63 v14.35,65.41 | IC4.16 22.62,61.36 22.22,60.96 v21.08,60.96
  Bottom 0.406: v14.35,65.41 16.64,65.41 v21.08,60.96
V_BAT  (via drill 0.6)
  Top 0.254: IC7.8 12.7,39.37 13.01,39.68 R32.2 | IC7.6 15.8,35.77 v16.51,35.05 | IC7.5 14.13,32.38 v15.24,32.38
  Top 0.406: L1.P$1 19.89,44.02 19.05,43.18 JP6.2 16.51,40.64 15.55,39.68 R32.2 | C13.+ 2.56,27.92 3.05,27.43 9.65,27.43 v10.67,28.45
  Bottom 0.406: JP6.2 v16.51,35.05 15.24,33.78 v15.24,32.38 15.24,29.21 11.43,25.4 | BAT1.PWR@1 7.62,21.59 11.43,25.4 | v10.67,28.45 10.67,26.16 11.43,25.4
VBUS
  Top 0.305: 4.51,44.13 IC6.4 | C12.+ 5.23,36.98 5.71,37.46 5.71,40.64 4.51,41.84 4.51,44.13 | 4.51,44.13 3.81,44.83 3.81,52.07 5.46,53.72 5.46,59.94 3.81,61.59 3.81,66.04 5.46,67.69 5.46,70.87 6.35,71.75 R20.2 12.45,71.69 12.45,66.04 11.85,65.44 X1.VBUS
  Top 0.406: LED5.A C12.+
XBEE_SLEEP  (via drill 0.6)
  Top 0.305: v36.2,60.32 36.2,58.83 IC2.17
  Top 0.406: U1.13 14.61,77.22 16.38,75.44 22.35,75.44 J1.3 | U$1.9 54.41,78.54 52.07,76.2 48.26,76.2 46.99,74.93 46.99,72.39 48.26,71.12 54.61,71.12 | v81.91,80.64 81.91,76.83 81.28,76.2 80.01,76.2 78.74,74.93 78.74,72.39 77.47,71.12 54.61,71.12 | 54.61,71.12 R25.2
  Bottom 0.305: J1.3 31.75,67.31 32.38,67.95 35.56,67.95 36.2,67.31 v36.2,60.32
  Bottom 0.406: v81.91,80.64 78.74,83.82 34.16,83.82 32.26,81.91 17.91,81.91 14.73,78.74 U1.13

### Text on the board
Document: OC2A CH3 | OC1B CH2 | OC1A CH1 | Board Dimensions: 106 x 90 mm | USB UART | XBEE MODULE | MICROCONTROLLER | POWER SUPPLY | ANALOG MUX | BUZZER | A0 | A1 | A2 | A3 | A4 | A5 | NC | +5V | GND | GND | RESET | +3.3V | AA 3.6 V Li-Ion Cell | ADJUSTABLE VOLTAGE SOURCE
Reference: ArduinoLab Motherboard v0.9 | Great Global Hackerspace Challenge 2011 | Design by Luke Weston and Marc Alexander, 2011 | Released under the TAPR Open Hardware License: www.tapr.org/OHL | Open Source Hardware | AREF | GND | 13 | 12 | 11 | 10 | 9 | 8 | 7 | 6 | 5 | 4 | 3 | 2 | 1 | 0 | 1 | . | + | 47 uH | KS0108B Graphics LCD Display | 1 k | TPS61202 | - | 1 | POTENTIOMETER | POTENTIOMETER | X0 | X1 | +5V | MEASURE | GND | GND | ANALOG Y0 | ANALOG Y1 | ANALOG BUTTONS | ADJ PSU OUTPUT
tDocu: Connected Community Hackerspace Melbourne | http://hackmelbourne.org